# EasyEDA Pro project mpair.eprj

# Schematic mpair

## Sheets
1 POE: Board Name: MPAIR; Create Date: 2026-01-03; Page Name: POE; Project Name: mpair; Schematic Name: mpair; Update Date: 2026-01-04; Company: EasyEDA.com; Page Size: A4; Version: V1.0
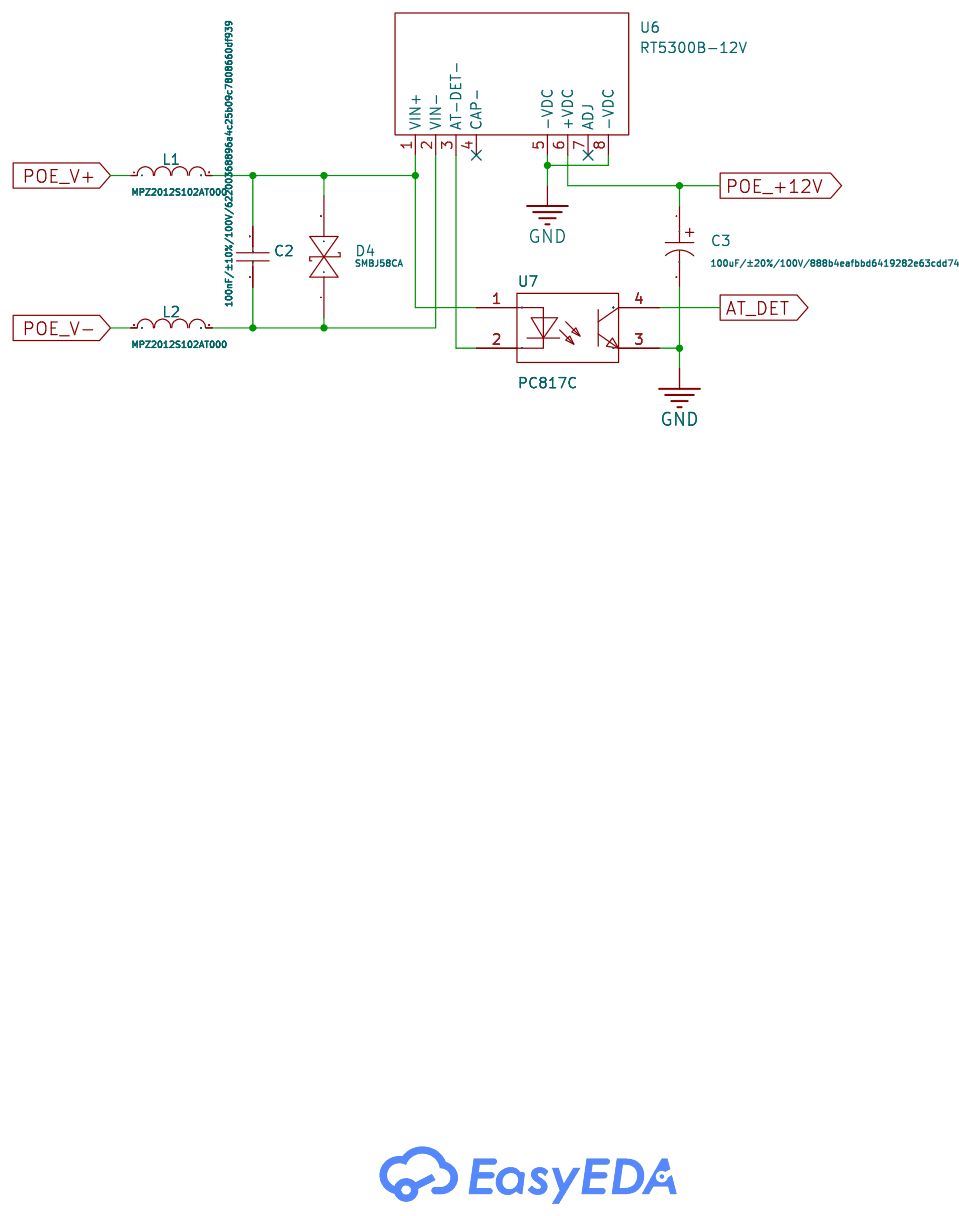
[diagram p0: POE]
2 LAN: Page Name: LAN
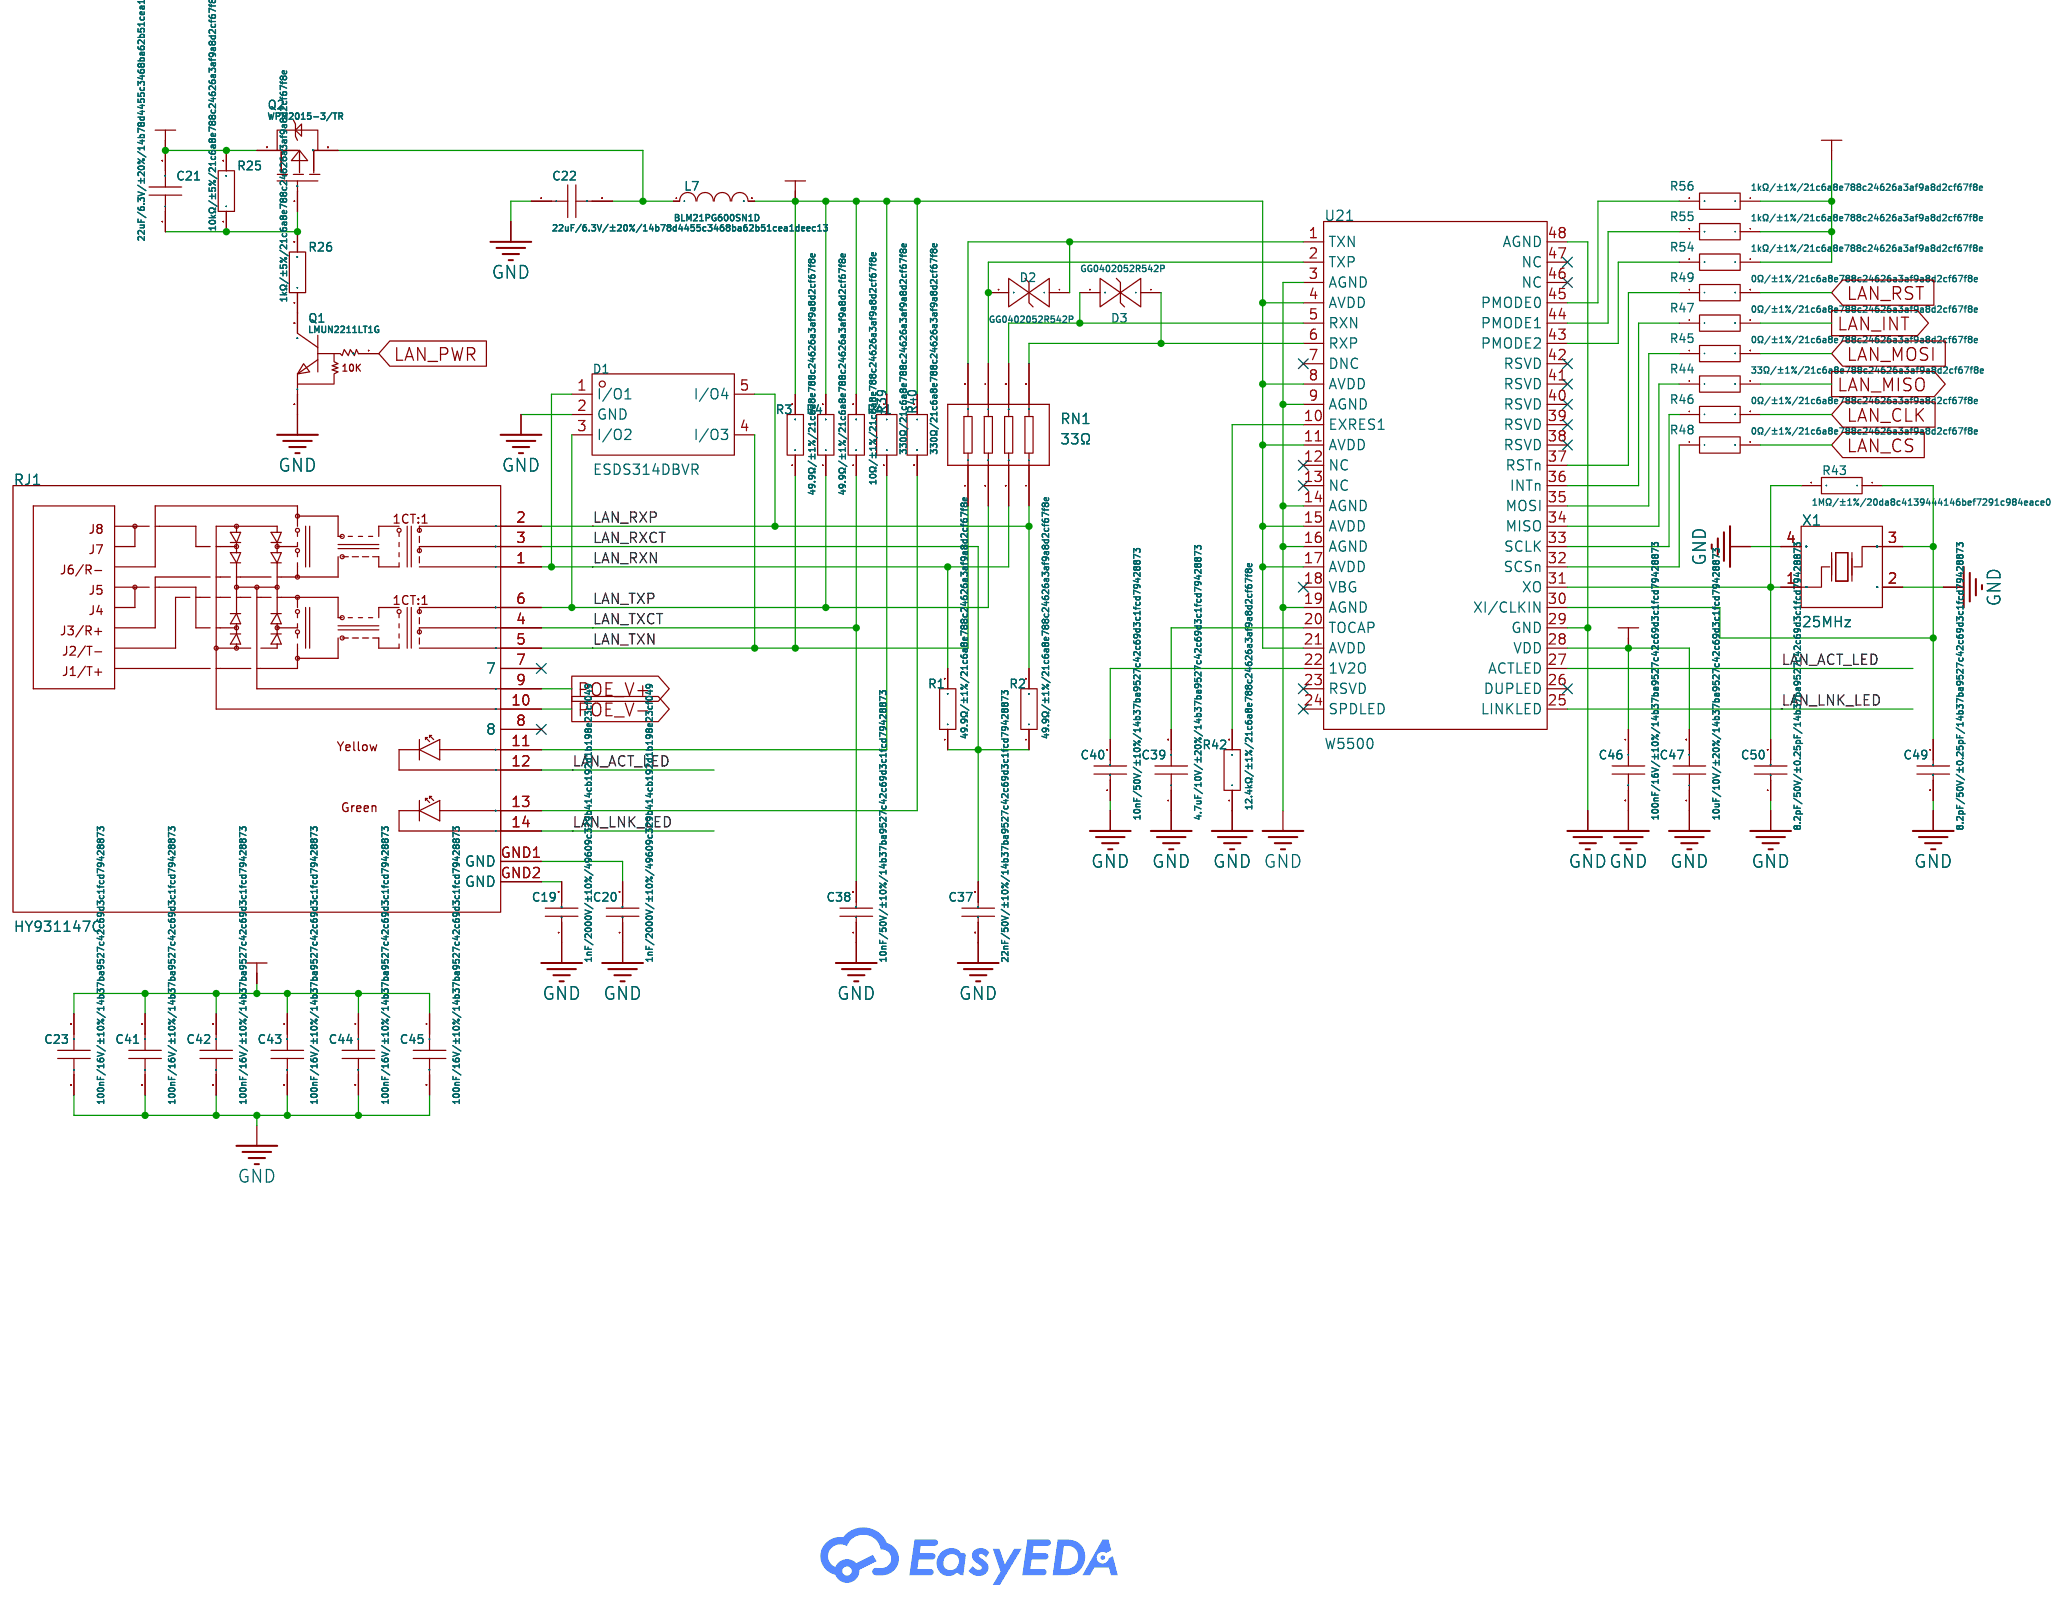
[diagram p1: LAN]
3 ESP32-C6: Page Name: ESP32-C6; Update Date: 2026-01-05
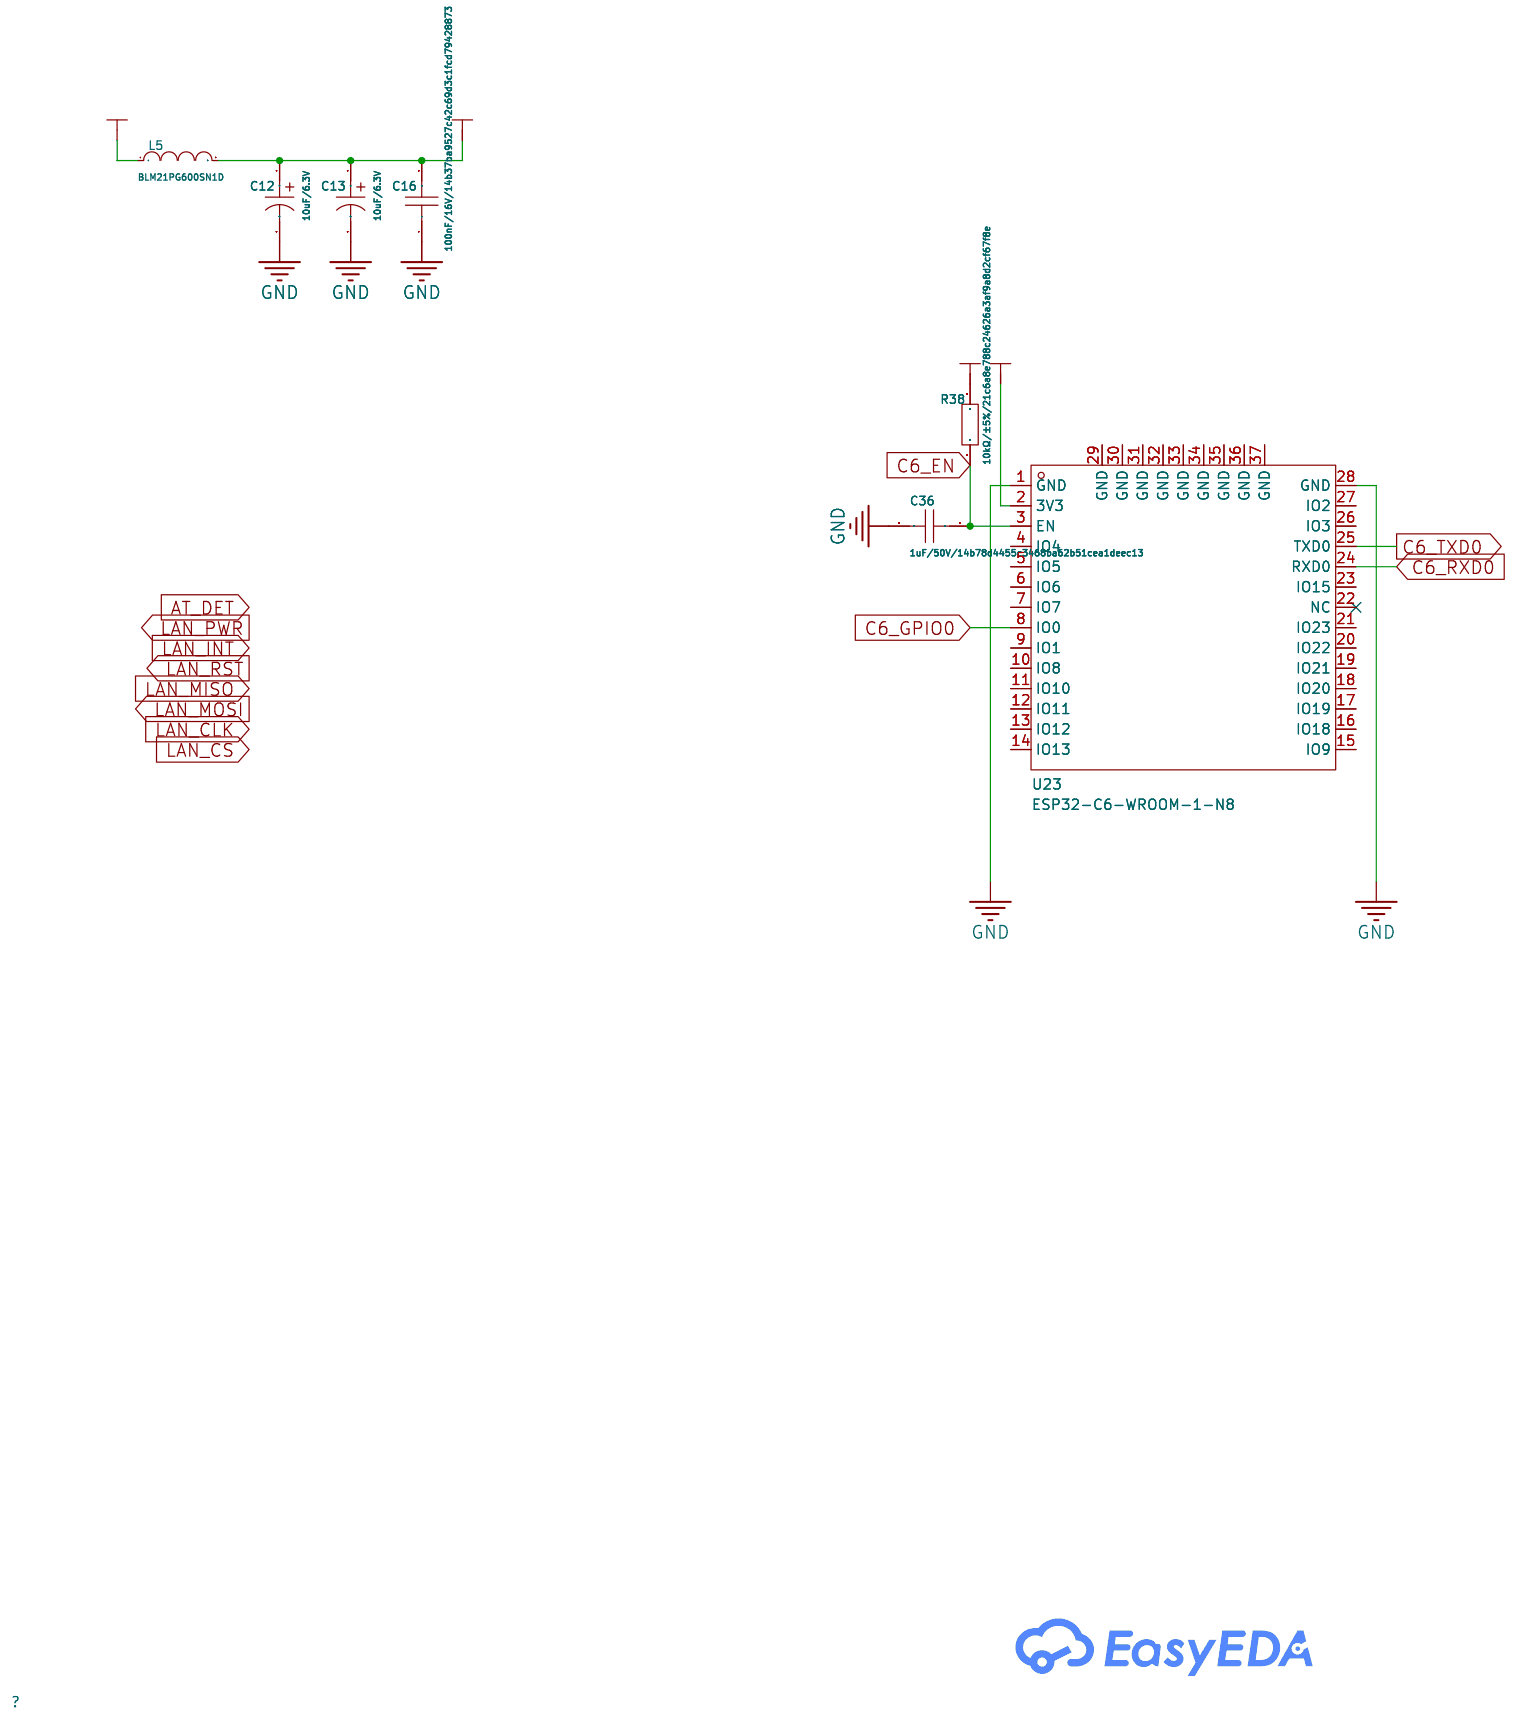
[diagram p2: ESP32-C6]
4 GPS: Page Name: GPS; Update Date: 2026-01-03
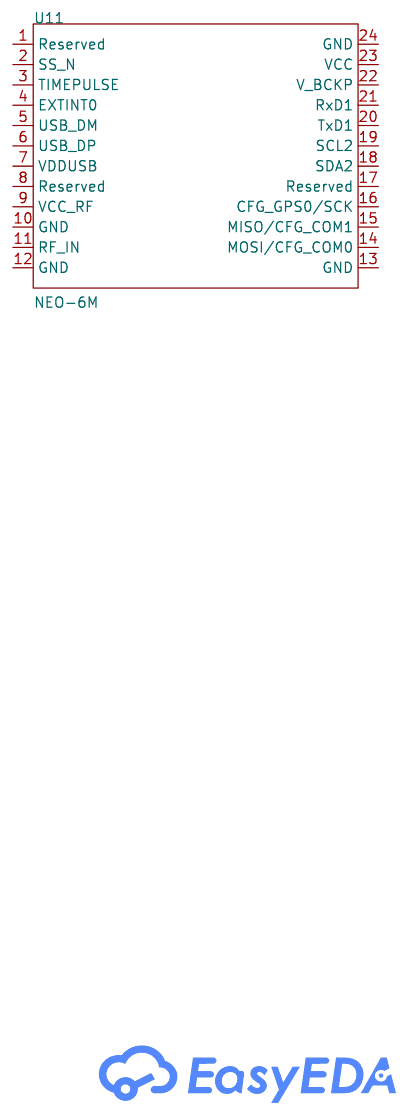
[diagram p3: GPS]
5 SPS30: Page Name: SPS30; Update Date: 2026-01-03
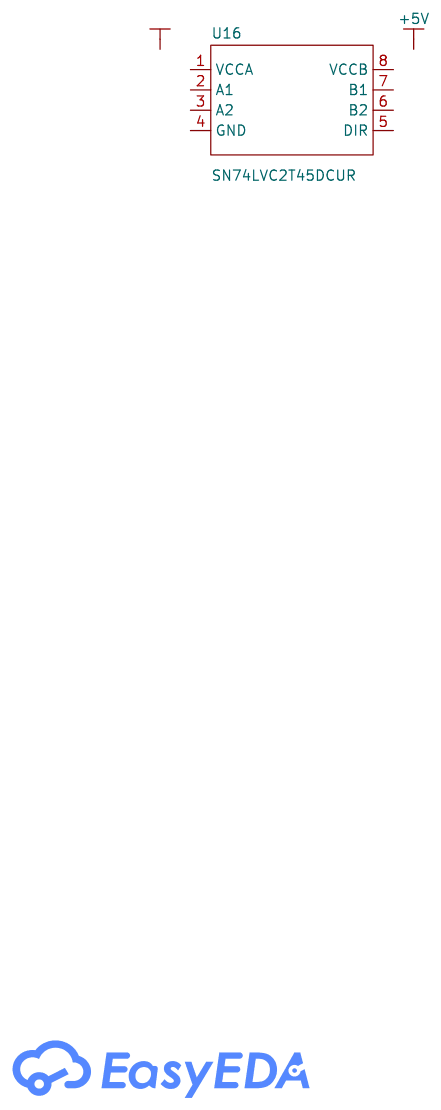
[diagram p4: SPS30]
6 OTHERS: Page Name: OTHERS; Update Date: 2026-01-03
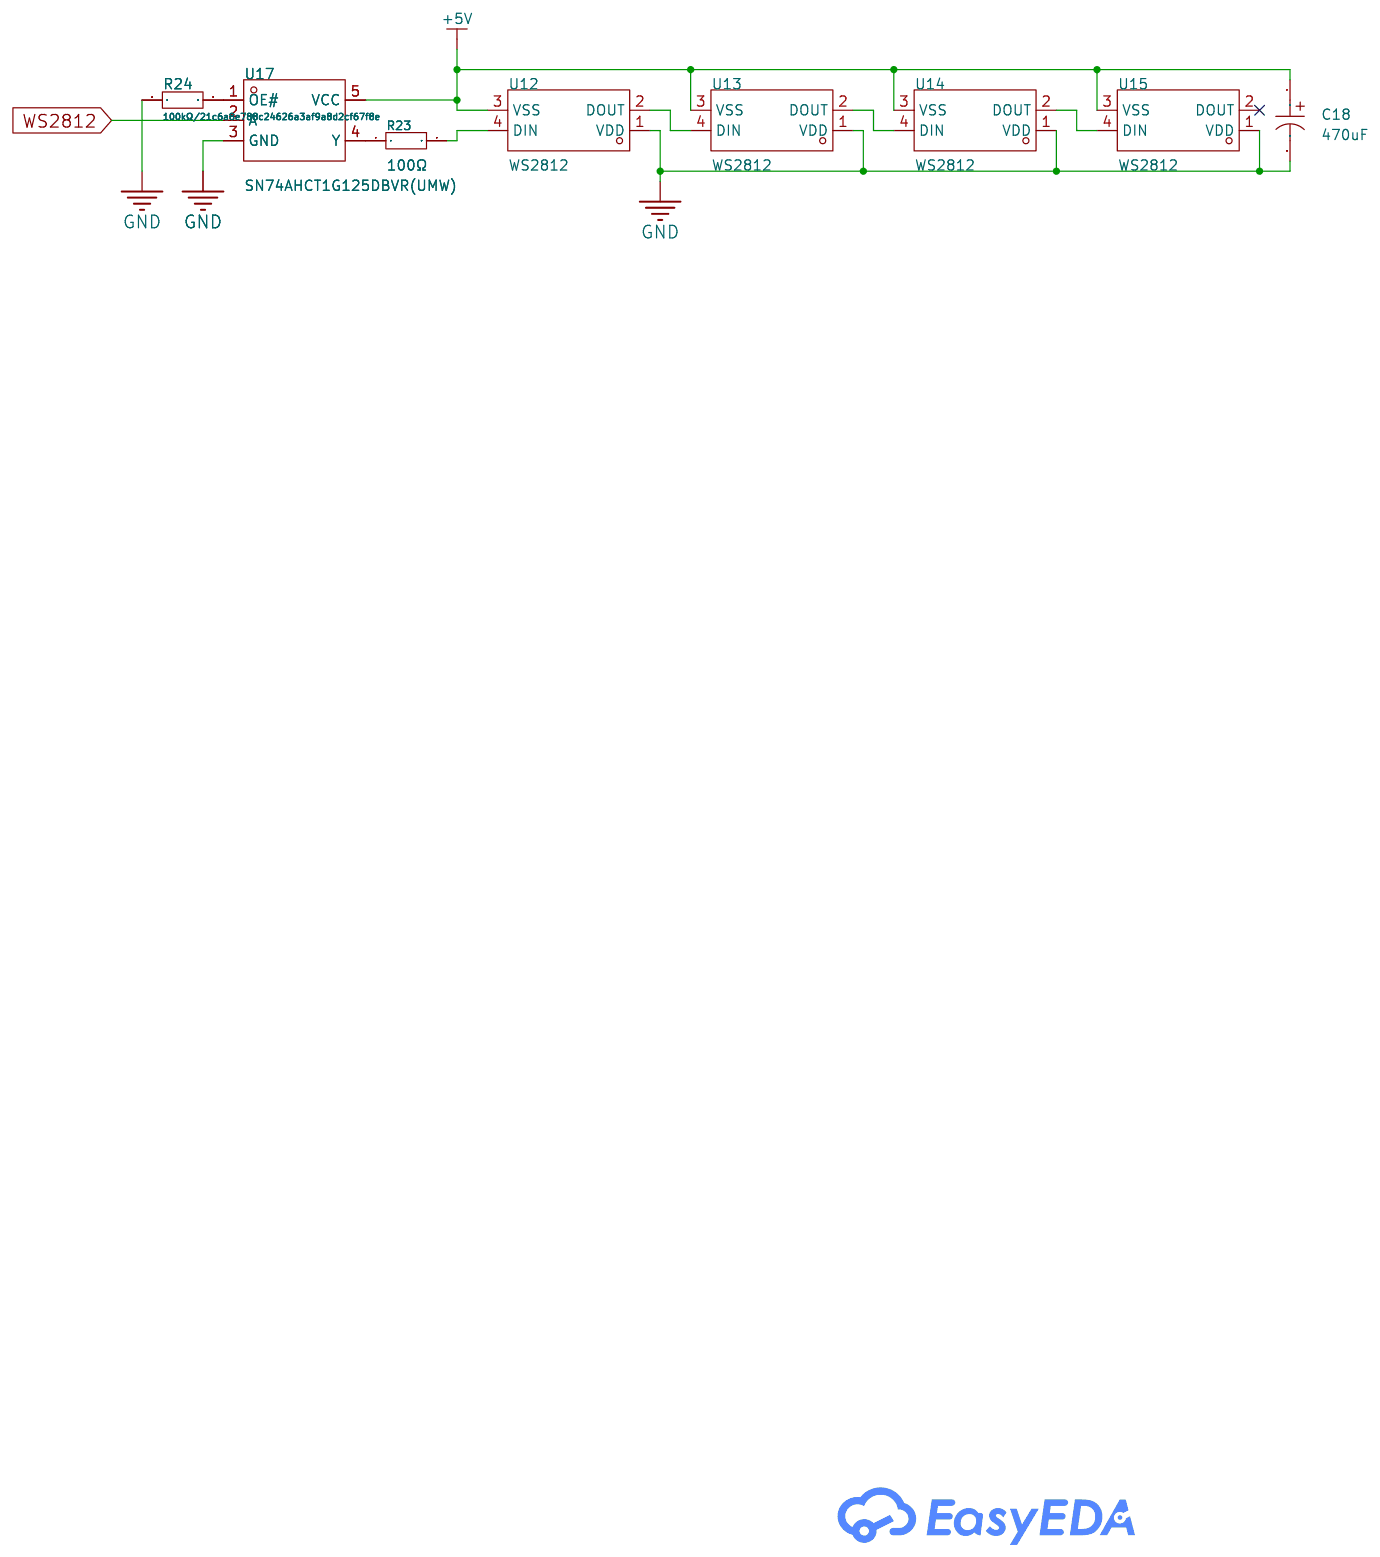
[diagram p5: OTHERS]
7 Power supply: Create Date: 2026-01-04; Page Name: Power supply
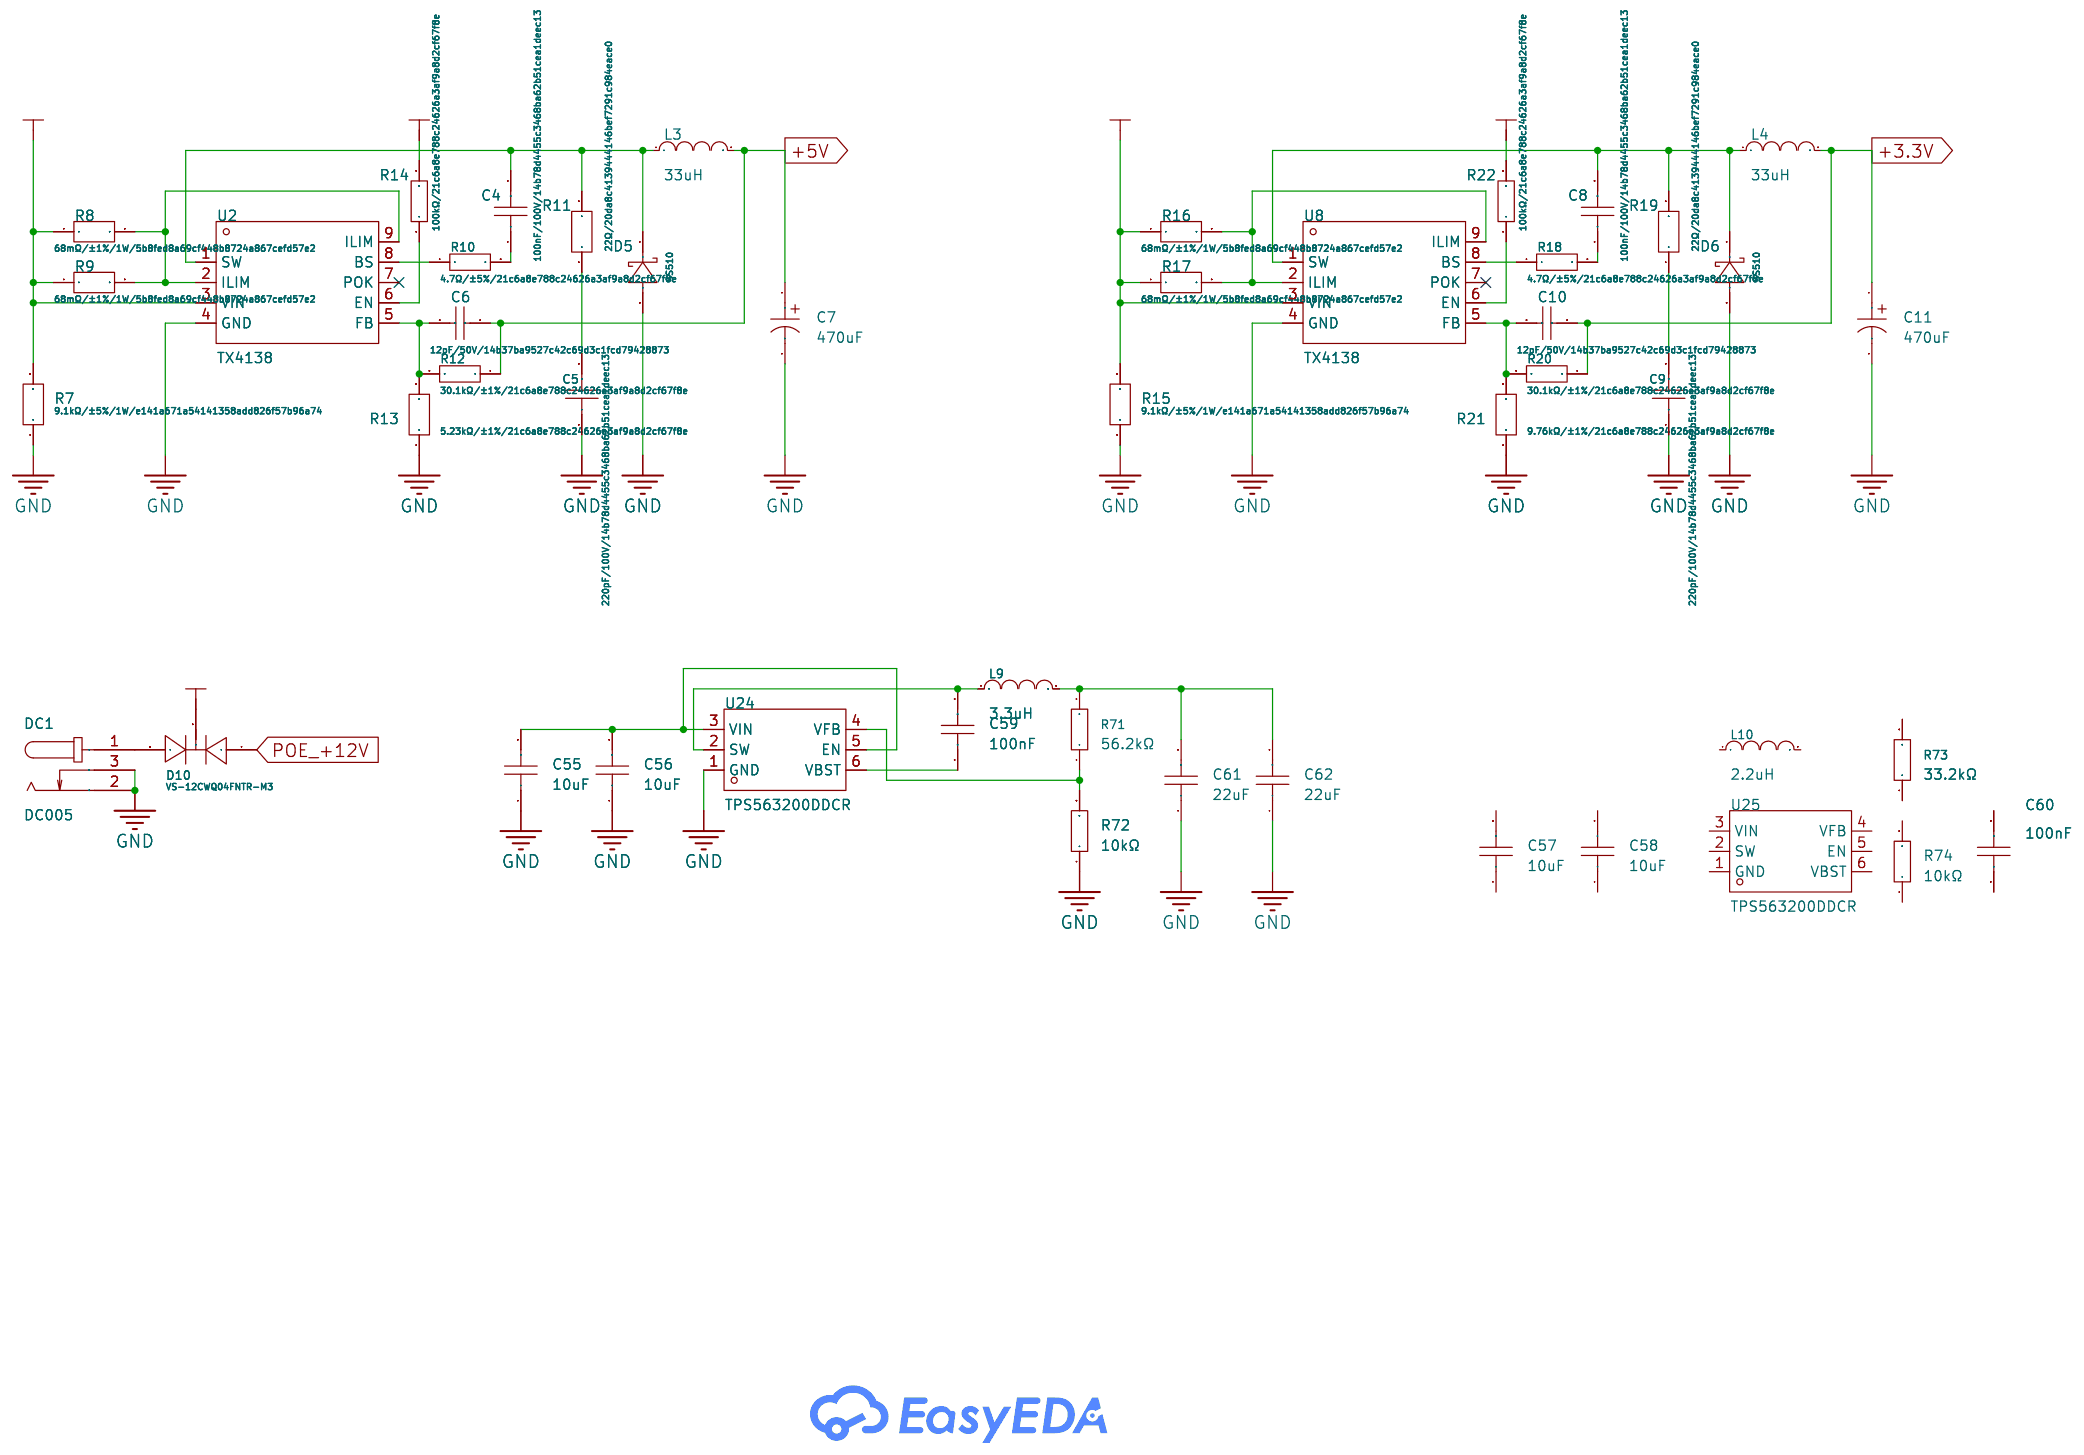
[diagram p6: Power supply]
8 USB->UART: Create Date: 2026-01-04; Page Name: USB->UART; Update Date: 2026-01-05
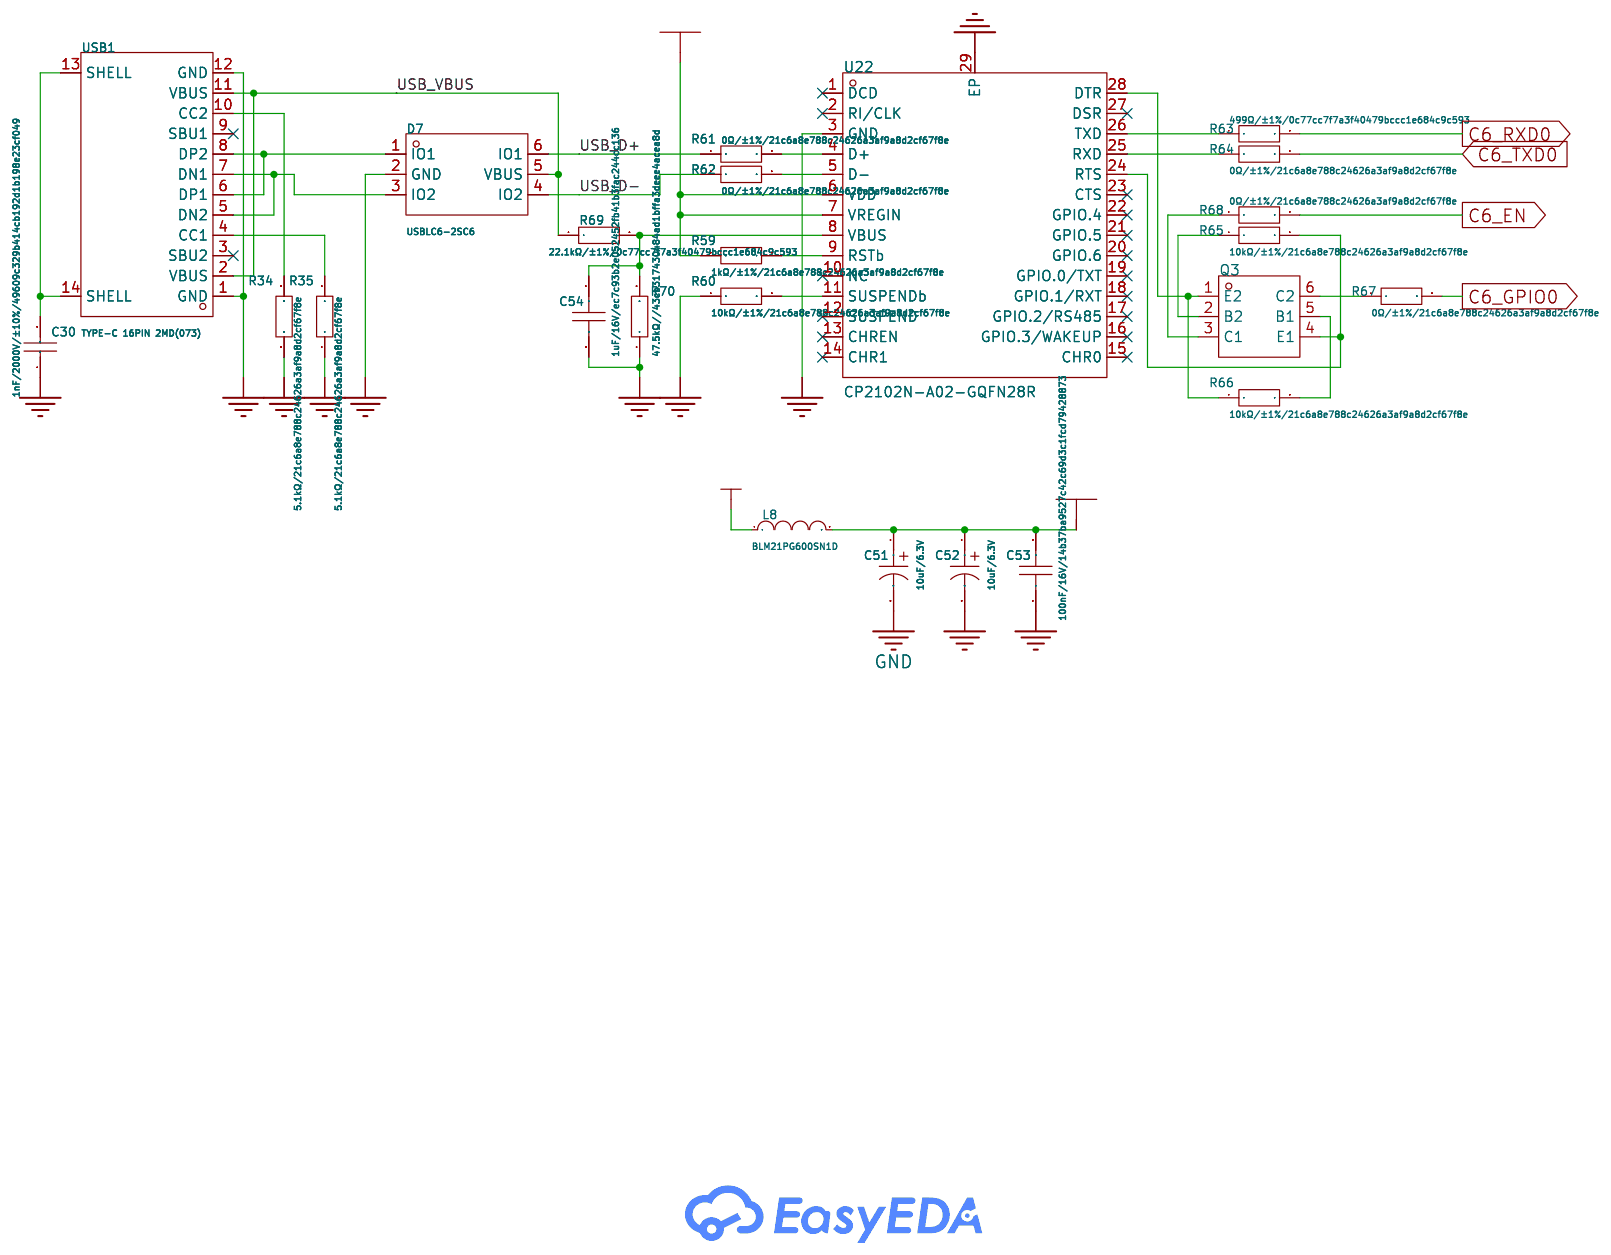
[diagram p7: USB->UART]

## Parts
sheet ESP32-C6
C12  10uF  [CAP-SMD_L2.0-W1.3-FD]
C13  10uF  [CAP-SMD_L2.0-W1.3-FD]
C16  100nF  [C0402]
C36  1uF  [C0603]
L5  BLM21PG600SN1D  [L0805]
R38  10kΩ  [R0402]
U23  ESP32-C6-WROOM-1-N8  [WIRELM-SMD_ESP32-C6-WROOM-1]
sheet GPS
U11  NEO-6M  [GPSM-SMD_24P-L16.0-W12.2-P1.10]
sheet LAN
C19  1nF  [C1206]
C20  1nF  [C1206]
C21  22uF  [C0603]
C22  22uF  [C0603]
C23  100nF  [C0402]
C37  22nF  [C0402]
C38  10nF  [C0402]
C39  4.7uF  [C0402]
C40  10nF  [C0402]
C41  100nF  [C0402]
C42  100nF  [C0402]
C43  100nF  [C0402]
C44  100nF  [C0402]
C45  100nF  [C0402]
C46  100nF  [C0402]
C47  10uF  [C0402]
C49  8.2pF  [C0402]
C50  8.2pF  [C0402]
D1  ESDS314DBVR  [SOT-23-5_L2.9-W1.6-P0.95-LS2.8-BL]
D2  GG0402052R542P  [D0402-BI]
D3  GG0402052R542P  [D0402-BI]
L7  BLM21PG600SN1D  [L0805]
Q1  LMUN2211LT1G  [SOT-23-3_L2.9-W1.3-P1.90-LS2.4-BR]
Q2  WPM2015-3/TR  [SOT-23-3_L2.9-W1.3-P1.90-LS2.4-BR]
R1  49.9Ω  [R0402]
R2  49.9Ω  [R0402]
R3  49.9Ω  [R0402]
R4  49.9Ω  [R0402]
R25  10kΩ  [R0402]
R26  1kΩ  [R0402]
R39  330Ω  [R0402]
R40  330Ω  [R0402]
R41  10Ω  [R0402]
R42  12.4kΩ  [R0402]
R43  1MΩ  [R0603]
R44  33Ω  [R0402]
R45  0Ω  [R0402]
R46  0Ω  [R0402]
R47  0Ω  [R0402]
R48  0Ω  [R0402]
R49  0Ω  [R0402]
R54  1kΩ  [R0402]
R55  1kΩ  [R0402]
R56  1kΩ  [R0402]
RJ1  HY931147C  [RJ45-TH_HY931147C]
RN1  33Ω  [RES-ARRAY-SMD_0402-8P-L2.0-W1.0-BL]
U21  W5500  [LQFP-48_L7.0-W7.0-P0.50-LS9.0-BL]
X1  25MHz  [CRYSTAL-SMD_4P-L3.2-W2.5-BL-2]
sheet OTHERS
C18  470uF  [CAP-SMD_BD6.3-L6.6-W6.6-LS7.6-RD]
R23  100Ω  [R0402]
R24  100kΩ  [R0402]
U12  WS2812  [LED-SMD_4P-L5.0-W5.0-TL-A]
U13  WS2812  [LED-SMD_4P-L5.0-W5.0-TL-A]
U14  WS2812  [LED-SMD_4P-L5.0-W5.0-TL-A]
U15  WS2812  [LED-SMD_4P-L5.0-W5.0-TL-A]
U17  SN74AHCT1G125DBVR(UMW)  [SOT-23-5_L3.0-W1.5-P0.95-LS2.8-BL]
sheet POE
C2  100nF  [C0805]
C3  100uF  [CAP-TH_BD10.0-P5.00-D0.6-FD]
D4  SMBJ58CA  [SMB_L4.6-W3.6-LS5.3-BI]
L1  MPZ2012S102AT000  [L0805]
L2  MPZ2012S102AT000  [L0805]
U6  RT5300B-12V  [PWRM-TH_RT5300B-12V]
U7  PC817C  [SOP-4_L6.5-W4.6-P2.54-LS10.2-TL]
sheet Power supply
C4  100nF  [C0603]
C5  220pF  [C0603]
C6  12pF  [C0402]
C7  470uF  [CAP-SMD_BD6.3-L6.6-W6.6-LS7.6-RD]
C8  100nF  [C0603]
C9  220pF  [C0603]
C10  12pF  [C0402]
C11  470uF  [CAP-SMD_BD6.3-L6.6-W6.6-LS7.6-RD]
C55  10uF  [C1210]
C56  10uF  [C1210]
C57  10uF  [C1210]
C58  10uF  [C1210]
C59  100nF  [C0603]
C60  100nF  [C0603]
C61  22uF  [C0805]
C62  22uF  [C0805]
D5  SS510  [SMA_L4.3-W2.6-LS5.1-RD]
D6  SS510  [SMA_L4.3-W2.6-LS5.1-RD]
D10  VS-12CWQ04FNTR-M3  [DPAK-3_L6.6-W6.1-P2.28-LS9.9-BR]
DC1  DC005  [DC-IN-TH_DC005]
L3  33uH  [IND-SMD_L12.5-W12.5]
L4  33uH  [IND-SMD_L12.5-W12.5]
L9  3.3uH  [IND-SMD_L6.0-W6.0]
L10  2.2uH  [IND-SMD_L4.0-W4.0_LQH44PN2R2MP0L]
R7  9.1kΩ  [R2512]
R8  68mΩ  [R1206]
R9  68mΩ  [R1206]
R10  4.7Ω  [R0402]
R11  22Ω  [R0603]
R12  30.1kΩ  [R0402]
R13  5.23kΩ  [R0402]
R14  100kΩ  [R0402]
R15  9.1kΩ  [R2512]
R16  68mΩ  [R1206]
R17  68mΩ  [R1206]
R18  4.7Ω  [R0402]
R19  22Ω  [R0603]
R20  30.1kΩ  [R0402]
R21  9.76kΩ  [R0402]
R22  100kΩ  [R0402]
R71  56.2kΩ  [R0603]
R72  10kΩ  [R0805]
R73  33.2kΩ  [R0603]
R74  10kΩ  [R0805]
U2  TX4138  [SOIC-8_L4.9-W3.9-P1.27-LS6.0-BL-EP]
U8  TX4138  [SOIC-8_L4.9-W3.9-P1.27-LS6.0-BL-EP]
U24  TPS563200DDCR  [SOT-23-6_L2.9-W1.6-P0.95-LS2.8-BR]
U25  TPS563200DDCR  [SOT-23-6_L2.9-W1.6-P0.95-LS2.8-BR]
sheet SPS30
U16  SN74LVC2T45DCUR  [VSSOP-8_L2.4-W2.1-P0.50-LS3.2-BR]
sheet USB->UART
C30  1nF  [C1206]
C51  10uF  [CAP-SMD_L2.0-W1.3-FD]
C52  10uF  [CAP-SMD_L2.0-W1.3-FD]
C53  100nF  [C0402]
C54  1uF  [C0402]
D7  USBLC6-2SC6  [SOT-23-6_L2.9-W1.6-P0.95-LS2.8-BL]
L8  BLM21PG600SN1D  [L0805]
Q3  -  [SOT-363_L2.0-W1.3-P0.65-LS2.1-TL]
R34  5.1kΩ  [R0402]
R35  5.1kΩ  [R0402]
R59  1kΩ  [R0402]
R60  10kΩ  [R0402]
R61  0Ω  [R0402]
R62  0Ω  [R0402]
R63  499Ω  [R0402]
R64  0Ω  [R0402]
R65  10kΩ  [R0402]
R66  10kΩ  [R0402]
R67  0Ω  [R0402]
R68  0Ω  [R0402]
R69  22.1kΩ  [R0402]
R70  47.5kΩ  [R0603]
U22  CP2102N-A02-GQFN28R  [QFN-28_L5.0-W5.0-P0.50-TL-EP3.3]
USB1  TYPE-C 16PIN 2MD(073)  [USB-C-SMD_TYPE-C-6PIN-2MD-073]

## Library data of the parts
C12 C13 C51 C52 = CA45-P-6.3V-10UF-K: LCSC Part Name: 10uF ±10% 6.3V; Supplier Part: C2844395; Manufacturer: CEC(振华新云); Supplier Footprint: CASE-P-2012-12(mm); JLCPCB Part Class: Extended Part; Datasheet: https://item.szlcsc.com/datasheet/CA45-P-6.3V-10UF-K/3035205.html; Supplier: LCSC; Tolerance: ±10%; Voltage Rating: 6.3V; Current - Leakage: 600nA; Operating Temperature: -55℃~+125℃
C16 C23 C41-C46 C53 = CL05B104KO5NNNC: LCSC Part Name: 100nF ±10% 16V; Supplier Part: C1525; Manufacturer: SAMSUNG(三星); Supplier Footprint: 0402; JLCPCB Part Class: Basic Part; Datasheet: https://item.szlcsc.com/datasheet/CL05B104KO5NNNC/1877.html; Supplier: LCSC; Tolerance: ±10%; Voltage Rating: 16V; Temperature Coefficient: X7R
C36 = CL10A105KB8NNNC: LCSC Part Name: 1uF ±10% 50V; Supplier Part: C15849; Manufacturer: SAMSUNG(三星); Supplier Footprint: 0603; JLCPCB Part Class: Basic Part; Datasheet: https://item.szlcsc.com/datasheet/CL10A105KB8NNNC/16531.html; Supplier: LCSC; Tolerance: ±10%; Voltage Rating: 50V; Temperature Coefficient: X5R
L5 L7 L8 = BLM21PG600SN1D: LCSC Part Name: 单路 0805磁珠 阻抗60Ω@100MHz; Supplier Part: C18305; Manufacturer: muRata(村田); Supplier Footprint: 0805; JLCPCB Part Class: Extended Part; Datasheet: https://item.szlcsc.com/datasheet/BLM21PG600SN1D/19000.html; Supplier: LCSC; Impedance @ Frequency: 60Ω@100MHz; Tolerance: ±25%; DC Resistance(DCR): 20mΩ; Current Rating: 3.5A; Number of Circuits: 1
R25 R38 = RC0402JR-0710KL: LCSC Part Name: 厚膜电阻 10kΩ ±5% 62.5mW; Supplier Part: C60489; Manufacturer: YAGEO(国巨); Supplier Footprint: 0402; JLCPCB Part Class: Extended Part; Datasheet: https://item.szlcsc.com/datasheet/RC0402JR-0710KL/61541.html; Supplier: LCSC; Type: Thick Film Resistors; Tolerance: ±5%; Power(Watts): 62.5mW; Voltage-Supply(Max): 50V; Temperature Coefficient: ±100ppm/℃; Operating Temperature: -55℃~+155℃
U23 = ESP32-C6-WROOM-1-N8: Supplier Part: C5366877; Manufacturer: ESPRESSIF(乐鑫); JLCPCB Part Class: Extended Part; Datasheet: https://item.szlcsc.com/datasheet/ESP32-C6-WROOM-1-N8/6203223.html; Supplier: LCSC
U11 = NEO-6M: Supplier Part: C2927633; JLCPCB Part Class: Extended Part; Supplier: LCSC
C19 C20 C30 = 1206B102K202NT: LCSC Part Name: 1nF ±10% 2kV; Supplier Part: C9196; Manufacturer: FH(风华); Supplier Footprint: 1206; JLCPCB Part Class: Basic Part; Datasheet: https://atta.szlcsc.com/upload/public/pdf/source/20200305/C486355_26A10D38EF8C2A5C37091D0039909270.pdf; Supplier: LCSC; Tolerance: ±10%; Voltage Rating: 2000V; Temperature Coefficient: X7R
C21 C22 = CL10A226MQ8NRNC: LCSC Part Name: 22uF ±20% 6.3V; Supplier Part: C59461; Manufacturer: SAMSUNG(三星); Supplier Footprint: 0603; JLCPCB Part Class: Basic Part; Datasheet: https://item.szlcsc.com/datasheet/CL10A226MQ8NRNC/60514.html; Supplier: LCSC; Tolerance: ±20%; Voltage Rating: 6.3V; Temperature Coefficient: X5R
C37 = CL05B223KB5NNNC: LCSC Part Name: 22nF ±10% 50V; Supplier Part: C337699; Manufacturer: SAMSUNG(三星); Supplier Footprint: 0402; JLCPCB Part Class: Extended Part; Datasheet: https://item.szlcsc.com/datasheet/CL05B223KB5NNNC/315756.html; Supplier: LCSC; Tolerance: ±10%; Voltage Rating: 50V; Temperature Coefficient: X7R
C38 C40 = CC0402KRX7R9BB103: LCSC Part Name: 10nF ±10% 50V; Supplier Part: C60133; Manufacturer: YAGEO(国巨); Supplier Footprint: 0402; JLCPCB Part Class: Extended Part; Datasheet: https://item.szlcsc.com/datasheet/CC0402KRX7R9BB103/61185.html; Supplier: LCSC; Tolerance: ±10%; Voltage Rating: 50V; Temperature Coefficient: X7R
C39 = V475M0402X5R100NCT: LCSC Part Name: 4.7uF ±20% 10V; Supplier Part: C2691404; Manufacturer: VIIYONG(微容); Supplier Footprint: 0402; JLCPCB Part Class: Extended Part; Datasheet: https://item.szlcsc.com/datasheet/V475M0402X5R100NCT/2800924.html; Supplier: LCSC; Tolerance: ±20%; Voltage Rating: 10V
C47 = CL05A106MP5NUNC_C315248: LCSC Part Name: 10uF ±20% 10V; Supplier Part: C315248; Manufacturer: SAMSUNG(三星); Manufacturer Part: CL05A106MP5NUNC; Supplier Footprint: 0402; JLCPCB Part Class: Extended Part; Datasheet: https://item.szlcsc.com/datasheet/CL05A106MP5NUNC/297154.html; Supplier: LCSC; Tolerance: ±20%; Voltage Rating: 10V; Temperature Coefficient: X5R
C49 C50 = 0402CG8R2C500NT: LCSC Part Name: ±0.25pF 8.2pF 50V; Supplier Part: C1579; Manufacturer: FH(风华); Supplier Footprint: 0402; JLCPCB Part Class: Extended Part; Datasheet: https://item.szlcsc.com/datasheet/0402CG8R2C500NT/1931.html; Supplier: LCSC; Voltage Rating: 50V; Temperature Coefficient: C0G; Tolerance: ±0.25pF
D1 = ESDS314DBVR: LCSC Part Name: 单向ESD 3.6V截止 峰值浪涌电流：25A@8/20us; Supplier Part: C1847859; Manufacturer: TI(德州仪器); Supplier Footprint: SOT-23-5; JLCPCB Part Class: Extended Part; Datasheet: https://www.ti.com/cn/lit/gpn/esds314; Supplier: LCSC; Polarity: Unidirectional; Reverse Stand-Off Voltage (Vrwm): 3.6V; Clamping Voltage: 6.5V; Peak Pulse Current (Ipp): 25A@8/20us; Peak Pulse Power Dissipation (Ppp): 170W@8/20us; Voltage - Breakdown: 7.5V; Reverse Leakage Current (Ir): 5nA; Number of Channels: 4; Operating Temperature: -40℃~+125℃; level of protection: IEC 61000-4-4；IEC 61000-4-5；IEC 61000-4-2; Type: ESD; Junction Capacitance: 4.5pF
D2 D3 = GG0402052R542P: LCSC Part Name: ESD 5V截止 峰值脉冲电流：3A@8/20us; Supplier Part: C1973257; Manufacturer: Kyocera AVX; Supplier Footprint: 0402; JLCPCB Part Class: Extended Part; Supplier: LCSC; Reverse Stand-Off Voltage (Vrwm): 5V; Clamping Voltage: 15.5V; Peak Pulse Current (Ipp): 3A@8/20us; Peak Pulse Power Dissipation (Ppp): 46W@8/20us; Voltage - Breakdown: 5.5V; Reverse Leakage Current (Ir): 100nA; Operating Temperature: -55℃~+125℃; level of protection: IEC 61000-4-4；IEC 61000-4-2; Type: ESD; Junction Capacitance: 2.5pF
Q1 = LMUN2211LT1G: LCSC Part Name: 偏置电阻晶体管，带单片偏置电阻网络的NPN硅表面贴装晶体管; Supplier Part: C12775; Manufacturer: LRC(乐山无线电); Supplier Footprint: SOT-23; JLCPCB Part Class: Extended Part; Datasheet: https://item.szlcsc.com/datasheet/LMUN2211LT1G/13416.html; Supplier: LCSC; Collector - Emitter Voltage VCEO: 50V; Current - Collector(Ic): 100mA; Pd - Power Dissipation: 246mW; type: NPN; DC Current Gain: 35@5.0mA,10V; Output Voltage(VO(on)): 200mV; Input Resistor: 10kΩ; Resistor Ratio: 1; Operating Temperature: -55℃~+150℃
Q2 = WPM2015-3/TR_C7472861: LCSC Part Name: 耐压:20V 电流:2.8A; Supplier Part: C7472861; Manufacturer: TECH PUBLIC(台舟); Supplier Footprint: SOT-23; JLCPCB Part Class: Extended Part; Datasheet: https://item.szlcsc.com/datasheet/WPM2015-3%252FTR/8532708.html; Supplier: LCSC; Drain to Source Voltage: 20V; Current - Continuous Drain(Id): 2.8A; RDS(on): 80mΩ@2.5V,2A; Pd - Power Dissipation: 1.25W; Gate Threshold Voltage (Vgs(th)): 450mV; Gate Charge(Qg): 9.6nC@4.5V; Input Capacitance(Ciss): 1.16nF; Reverse Transfer Capacitance (Crss@Vds): 125pF; Operating Temperature: -55℃~+150℃; Output Capacitance(Coss): 210pF
R1-R4 = CR0402FF49R9G: LCSC Part Name: 厚膜电阻 49.9Ω ±1% 62.5mW; Supplier Part: C100459; Manufacturer: LIZ(丽智电子); Supplier Footprint: 0402; JLCPCB Part Class: Extended Part; Datasheet: https://atta.szlcsc.com/upload/public/pdf/source/20180403/C189438_6D658388CC7843F35BBC9018D03F0B8E.pdf; Supplier: LCSC; Type: Thick Film Resistors; Tolerance: ±1%; Temperature Coefficient: ±200ppm/℃; Operating Temperature Range: -55℃~+125℃
R26 = RC0402JR-071KL: LCSC Part Name: 厚膜电阻 1kΩ ±5% 62.5mW; Supplier Part: C105637; Manufacturer: YAGEO(国巨); Supplier Footprint: 0402; JLCPCB Part Class: Extended Part; Datasheet: https://item.szlcsc.com/datasheet/RC0402JR-071KL/106852.html; Supplier: LCSC; Type: Thick Film Resistor; Tolerance: ±5%; Power(Watts): 62.5mW; Voltage-Supply(Max): 50V; Temperature Coefficient: ±100ppm/℃; Operating Temperature: -55℃~+155℃
R39 R40 = FRC0402J331 TS: LCSC Part Name: 330Ω ±5% 62.5mW 厚膜电阻; Supplier Part: C2906929; Manufacturer: FOJAN(富捷); Supplier Footprint: 0402; JLCPCB Part Class: Extended Part; Supplier: LCSC; Type: Thick Film Resistor; Tolerance: ±5%; Power(Watts): 62.5mW; Voltage-Supply(Max): 50V; Temperature Coefficient: ±100ppm/℃; Operating Temperature: -55℃~+155℃
R41 = 0402WGF100JTCE: LCSC Part Name: 10Ω ±1% 62.5mW 厚膜电阻; Supplier Part: C25077; Manufacturer: UNI-ROYAL(厚声); Supplier Footprint: 0402; JLCPCB Part Class: Basic Part; Datasheet: https://item.szlcsc.com/datasheet/0402WGF100JTCE/25820.html; Supplier: LCSC; Type: Thick Film Resistor; Tolerance: ±1%; Power(Watts): 62.5mW; Voltage-Supply(Max): 50V; Temperature Coefficient: ±200ppm/℃; Operating Temperature: -55℃~+155℃
R42 = RC0402FR-0712K4L: LCSC Part Name: 厚膜电阻 12.4kΩ ±1% 62.5mW; Supplier Part: C138060; Manufacturer: YAGEO(国巨); Supplier Footprint: 0402; JLCPCB Part Class: Extended Part; Datasheet: https://item.szlcsc.com/datasheet/RC0402FR-0712K4L/149376.html; Supplier: LCSC; Type: Thick Film Resistor; Tolerance: ±1%; Power(Watts): 62.5mW; Voltage-Supply(Max): 50V; Temperature Coefficient: ±100ppm/℃; Operating Temperature: -55℃~+155℃
R43 = 0603WAF1004T5E: LCSC Part Name: 1MΩ ±1% 100mW 厚膜电阻; Supplier Part: C22935; Manufacturer: UNI-ROYAL(厚声); Supplier Footprint: 0603; JLCPCB Part Class: Basic Part; Datasheet: https://atta.szlcsc.com/upload/public/pdf/source/20200306/C422600_1E6D84923E4A46A82E41ADD87F860B5C.pdf; Supplier: LCSC; Type: Thick Film Resistors; Tolerance: ±1%; Temperature Coefficient: ±100ppm/℃; Operating Temperature Range: -55℃~+155℃
R44 = 0402WGF330JTCE: LCSC Part Name: 33Ω ±1% 62.5mW 厚膜电阻; Supplier Part: C25105; Manufacturer: UNI-ROYAL(厚声); Supplier Footprint: 0402; JLCPCB Part Class: Basic Part; Datasheet: https://item.szlcsc.com/datasheet/0402WGF330JTCE/25848.html; Supplier: LCSC; Type: Thick Film Resistor; Tolerance: ±1%; Power(Watts): 62.5mW; Voltage-Supply(Max): 50V; Temperature Coefficient: ±100ppm/℃; Operating Temperature: -55℃~+155℃
R45-R49 R61 R62 R64 R67 R68 = 0402WGF0000TCE: LCSC Part Name: 0Ω ±1% 62.5mW 厚膜电阻; Supplier Part: C17168; Manufacturer: UNI-ROYAL(厚声); Supplier Footprint: 0402; JLCPCB Part Class: Basic Part; Datasheet: https://item.szlcsc.com/datasheet/0402WGF0000TCE/17853.html; Supplier: LCSC; Type: Thick Film Resistor; Tolerance: ±1%; Power(Watts): 62.5mW; Voltage-Supply(Max): 50V; Temperature Coefficient: ±800ppm/℃; Operating Temperature: -55℃~+155℃
R54-R56 R59 = 0402WGF1001TCE: LCSC Part Name: 1kΩ ±1% 62.5mW 厚膜电阻; Supplier Part: C11702; Manufacturer: UNI-ROYAL(厚声); Supplier Footprint: 0402; JLCPCB Part Class: Basic Part; Datasheet: https://item.szlcsc.com/datasheet/0402WGF1001TCE/12256.html; Supplier: LCSC; Type: Thick Film Resistor; Tolerance: ±1%; Power(Watts): 62.5mW; Voltage-Supply(Max): 50V; Temperature Coefficient: ±100ppm/℃; Operating Temperature: -55℃~+155℃
RJ1 = HY931147C: LCSC Part Name: 弯插 带LED; Supplier Part: C91754; Manufacturer: HANRUN(汉仁); Supplier Footprint: 插件; JLCPCB Part Class: Extended Part; Datasheet: https://item.szlcsc.com/datasheet/HY931147C/92943.html; Supplier: LCSC; Connector Type: RJ45 Jack; Mounting Type: Right Angle; Number of Ports: 1; LED: With LED; Shielding: Shielded; PoE: With PoE; Supplementary Features: With Contact Spring
RN1 = YC124-FR-0733RL: LCSC Part Name: 33Ω ±1%; Supplier Part: C136851; Manufacturer: YAGEO(国巨); Supplier Footprint: 0402x4; JLCPCB Part Class: Extended Part; Datasheet: https://item.szlcsc.com/datasheet/YC124-FR-0733RL/148167.html; Supplier: LCSC; Tolerance: ±1%; Power(Watts): 62.5mW; Temperature Coefficient: ±200ppm/℃
U21 = W5500: LCSC Part Name: W5500硬连线TCP/IP嵌入式以太网控制器; Supplier Part: C32843; Manufacturer: WIZNET; Supplier Footprint: LQFP-48(7x7); JLCPCB Part Class: Extended Part; Datasheet: https://item.szlcsc.com/datasheet/W5500/33808.html; Supplier: LCSC; Number of Channels: 8; Interface: SPI; Voltage - Supply: 3.3V; Current - Supply: 132mA; Operating Temperature: -40℃~+85℃
X1 = X322525MSB4SI: LCSC Part Name: YSX321SL 25MHZ 4P 3225 20PF ±10PPM -40~85℃ (±20PPM); Supplier Part: C13740; Manufacturer: YXC(扬兴晶振); Supplier Footprint: SMD3225-4P; JLCPCB Part Class: Extended Part; Datasheet: https://item.szlcsc.com/datasheet/X322525MSB4SI/14395.html; Supplier: LCSC; Type: Crystal Oscillator; Normal temperature Frequency Tolerance: ±10ppm; Load Capacitance: 20pF; Frequency Stability: ±20ppm; Operating Temperature: -40℃~+85℃
C7 C11 C18 = RVT1C471M0607: LCSC Part Name: 470uF ±20% 16V; Supplier Part: C2977552; Manufacturer: ROQANG(容强); Supplier Footprint: SMD,D6.3xL7.7mm; JLCPCB Part Class: Extended Part; Supplier: LCSC; Tolerance: ±20%; Voltage Rating: 16V; Ripple Current: 185mA@120Hz; Diameter: 6.3mm; Height - Seated (Max): 7.7mm; Lifetime: 2000hrs@105℃; Operating Temperature: -40℃~+105℃
R23 = 0402WGJ0101TCE: LCSC Part Name: 100Ω ±5% 62.5mW 厚膜电阻; Supplier Part: C25138; Manufacturer: UNI-ROYAL(厚声); Supplier Footprint: 0402; JLCPCB Part Class: Extended Part; Datasheet: https://item.szlcsc.com/datasheet/0402WGJ0101TCE/25881.html; Supplier: LCSC; Type: Thick Film Resistor; Tolerance: ±5%; Power(Watts): 62.5mW; Voltage-Supply(Max): 50V; Temperature Coefficient: ±100ppm/℃; Operating Temperature: -55℃~+155℃
R14 R22 R24 = RC0402FR-07100KL: LCSC Part Name: 厚膜电阻 100kΩ ±1% 62.5mW; Supplier Part: C60491; Manufacturer: YAGEO(国巨); Supplier Footprint: 0402; JLCPCB Part Class: Extended Part; Datasheet: https://item.szlcsc.com/datasheet/RC0402FR-07100KL/61543.html; Supplier: LCSC; Type: Thick Film Resistor; Tolerance: ±1%; Power(Watts): 62.5mW; Voltage-Supply(Max): 50V; Temperature Coefficient: ±100ppm/℃; Operating Temperature: -55℃~+155℃
U12-U15 = WS2812: Supplier Part: C42417498; Manufacturer: worldsemi; Supplier Footprint: SMD5050-4P; JLCPCB Part Class: Extended Part; Datasheet: https://item.szlcsc.com/datasheet/WS2812/44423158.html; Supplier: LCSC
U17 = SN74AHCT1G125DBVR(UMW): Supplier Part: C20617903; Manufacturer: UMW(友台半导体); Supplier Footprint: SOT-23-5; JLCPCB Part Class: Extended Part; Datasheet: https://atta.szlcsc.com/upload/public/pdf/source/20240202/859E6FB7F814FD8595A6844FA9E492AF.pdf; Supplier: LCSC
C2 = CL21B104KCFNNNE: LCSC Part Name: 100nF ±10% 100V; Supplier Part: C28233; Manufacturer: SAMSUNG(三星); Supplier Footprint: 0805; JLCPCB Part Class: Basic Part; Datasheet: https://item.szlcsc.com/datasheet/CL21B104KCFNNNE/28983.html; Supplier: LCSC; Tolerance: ±10%; Voltage Rating: 100V; Temperature Coefficient: X7R
C3 = 100uF100V10x17GF: LCSC Part Name: 100uF ±20% 100V; Supplier Part: C49304981; Manufacturer: Econd(米朗电子); Supplier Footprint: 插件,D10xL17mm; JLCPCB Part Class: Extended Part; Datasheet: https://item.szlcsc.com/datasheet/100uF100V10x17GF/51766809.html; Supplier: LCSC; Tolerance: ±20%; Voltage Rating: 100V; Ripple Current: 540mA@100KHz; Equivalent Series Resistance(ESR): 200mΩ; Pin Spacing: 5mm; Diameter: 10mm; Height - Seated (Max): 17mm; Lifetime: 3000hrs@105℃; Operating Temperature: -40℃~+105℃
D4 = SMBJ58CA_C492914: Supplier Part: C492914; Manufacturer: SMC(桑德斯); Supplier Footprint: DO-214AA(SMB); JLCPCB Part Class: Extended Part; Datasheet: https://atta.szlcsc.com/upload/public/pdf/source/20200312/C493201_B8845F97AAB6FA9414561D1241F12A71.pdf; Supplier: LCSC; Polarity: Bidirectional; Reverse Stand-Off Voltage (Vrwm): 58V; Clamping Voltage: 93.6V; Peak Pulse Current (Ipp): 6.5A; Peak Pulse Power Dissipation (Ppp): 600W; Voltage - Breakdown: 64.4V; Type: TVS
L1 L2 = MPZ2012S102AT000: LCSC Part Name: 单路 0805磁珠 阻抗1kΩ@100MHz; Supplier Part: C76817; Manufacturer: TDK; Supplier Footprint: 0805; JLCPCB Part Class: Extended Part; Datasheet: https://item.szlcsc.com/datasheet/MPZ2012S102AT000/77944.html; Supplier: LCSC; Impedance @ Frequency: 1kΩ@100MHz; Tolerance: ±25%; DC Resistance(DCR): 150mΩ; Current Rating: 1.5A; Number of Circuits: 1; Operating Temperature: -55℃~+125℃
U6 = RT5300B-12V: Supplier Part: C9900202773; Supplier Footprint: Through hole; JLCPCB Part Class: Extended Part; Supplier: LCSC
U7 = PC817C_C22447129: Supplier Part: C22447129; Manufacturer: JSMSEMI(杰盛微); Supplier Footprint: SOP-4; JLCPCB Part Class: Extended Part; Datasheet: https://item.szlcsc.com/datasheet/PC817C/24102051.html; Supplier: LCSC; Input type: DC; Output Type: Phototransistor; Voltage - Forward(Vf): 1.2V; Output Current: 50mA; Isolation Voltage(Vrms): 5kV; Reverse Voltage: 6V; Load Voltage: 80V; Vce Saturation(VCE(sat)): 100mV@20mA,1mA; Rise time: 4us; Fall time: 3us; Operating Temperature: -55℃~+110℃; Current Transfer Ratio (CTR) Minimum: 80%; Current Transfer Ratio (CTR) Maximum/Saturation Value: 600%; Forward Current(If): 50mA
C4 C8 = FCC0603B104K101CT: LCSC Part Name: 100nF ±10% 100V; Supplier Part: C5137616; Manufacturer: FOJAN(富捷); Supplier Footprint: 0603; JLCPCB Part Class: Extended Part; Datasheet: https://item.szlcsc.com/datasheet/FCC0603B104K101CT/5747068.html; Supplier: LCSC; Tolerance: ±10%; Voltage Rating: 100V; Temperature Coefficient: X7R
C5 C9 = GCM1885C2A221JA16D: LCSC Part Name: 220pF ±5% 100V; Supplier Part: C388907; Manufacturer: muRata(村田); Supplier Footprint: 0603; JLCPCB Part Class: Extended Part; Datasheet: https://item.szlcsc.com/datasheet/GCM1885C2A221JA16D/364231.html; Supplier: LCSC; Tolerance: ±5%; Voltage Rating: 100V; Temperature Coefficient: C0G
C6 C10 = 0402CG120J500NT: LCSC Part Name: 12pF ±5% 50V; Supplier Part: C1547; Manufacturer: FH(风华); Supplier Footprint: 0402; JLCPCB Part Class: Basic Part; Datasheet: https://item.szlcsc.com/datasheet/0402CG120J500NT/1899.html; Supplier: LCSC; Tolerance: ±5%; Voltage Rating: 50V; Temperature Coefficient: C0G
C55-C58 = CS3225X7R106K500NRL: LCSC Part Name: 10uF 50V; Supplier Part: C2918502; Manufacturer: SAMWHA(三和); Supplier Footprint: 1210; JLCPCB Part Class: Extended Part; Datasheet: https://item.szlcsc.com/datasheet/CS3225X7R106K500NRL/3220354.html; Supplier: LCSC; Voltage Rating: 50V; Temperature Coefficient: X7R
C59 C60 = TCC0603X7R104K500CT: LCSC Part Name: 100nF ±10% 50V; Supplier Part: C282519; Manufacturer: CCTC(三环); Supplier Footprint: 0603; JLCPCB Part Class: Extended Part; Datasheet: https://item.szlcsc.com/datasheet/TCC0603X7R104K500CT/268639.html; Supplier: LCSC; Tolerance: ±10%; Voltage Rating: 50V; Temperature Coefficient: X7R
C61 C62 = FCC0805X226M250FT: LCSC Part Name: 22uF ±20% 25V; Supplier Part: C7419435; Manufacturer: FOJAN(富捷); Supplier Footprint: 0805; JLCPCB Part Class: Extended Part; Datasheet: https://item.szlcsc.com/datasheet/FCC0805X226M250FT/8393417.html; Supplier: LCSC; Tolerance: ±20%; Voltage Rating: 25V; Temperature Coefficient: X5R
D5 D6 = SS510_C47147615: LCSC Part Name: SBD肖特基二极管; Supplier Part: C47147615; Manufacturer: YONGYUTAI(永裕泰); Supplier Footprint: SMA; JLCPCB Part Class: Extended Part; Datasheet: https://item.szlcsc.com/datasheet/SS510/49348153.html; Supplier: LCSC; Voltage - DC Reverse(Vr): 100V; Current - Rectified: 5A; Non-Repetitive Peak Forward Surge Current: 100A
D10 = VS-12CWQ04FNTR-M3: LCSC Part Name: 电压:40V 电流:6A; Supplier Part: C468048; Manufacturer: VISHAY(威世); Supplier Footprint: DPAK(TO-252AA); JLCPCB Part Class: Extended Part; Datasheet: https://item.szlcsc.com/datasheet/VS-12CWQ04FNTR-M3/473463.html; Supplier: LCSC; Diode Configuration: 1 Pair Common Cathode; Voltage - Forward(Vf@If): 680mV@12A; Voltage - DC Reverse(Vr): 40V; Current - Rectified: 6A; Reverse Leakage Current (Ir): 3mA@40V; Operating Junction Temperature Range: -55℃~+150℃; Non-Repetitive Peak Forward Surge Current: 550A
DC1 = DC005: LCSC Part Name: DC电源插座 内径:2mm 外径:6.3mm; Supplier Part: C431533; Manufacturer: SHOU HAN(首韩); Supplier Footprint: 插件; JLCPCB Part Class: Extended Part; Datasheet: https://item.szlcsc.com/datasheet/DC005/427890.html; Supplier: LCSC; Connector Type: DC Power Jack; Mounting Type: Right Angle; Inside Contact Diameter: 2mm; Outside Contact Diameter: 6.3mm; Current Rating: 500mA; Voltage Rating (Max): 12V; Operating Temperature: -30℃~+70℃
L3 L4 = SMDRI129-330MT: LCSC Part Name: 33uH ±20% 4.25A; Supplier Part: C2924828; Manufacturer: SXN(顺翔诺); Supplier Footprint: SMD,12.5x12.5mm; JLCPCB Part Class: Extended Part; Datasheet: https://atta.szlcsc.com/upload/public/pdf/source/20211124/9B30950960349E81285E9EDEE1F3DB14.pdf; Supplier: LCSC; Tolerance: ±20%; Saturation Current (Isat): 4.25A; Type: 屏蔽电感
L9 = FNR6028S3R3MT: LCSC Part Name: 3.3uH ±20% 4.5A; Supplier Part: C528022; Manufacturer: cjiang(长江微电); Supplier Footprint: SMD,6x6mm; JLCPCB Part Class: Extended Part; Datasheet: https://item.szlcsc.com/datasheet/FNR6028S3R3MT/546332.html; Supplier: LCSC; Tolerance: ±20%; Current Rating: 3.8A; Current - Saturation(Isat): 4.5A; DC Resistance(DCR): 33mΩ; Type: Magnetic Shielded Inductor
L10 = SMNR4020-2.2UH: LCSC Part Name: 2.2uH ±20% 3.4A; Supplier Part: C135262; Manufacturer: SXN(顺翔诺); Supplier Footprint: SMD,4x4mm; JLCPCB Part Class: Extended Part; Datasheet: https://item.szlcsc.com/datasheet/SMNR4020-2.2UH/146573.html; Supplier: LCSC; Tolerance: ±20%; Current Rating: 3.4A; Current - Saturation(Isat): 3.4A; DC Resistance(DCR): 46mΩ
R7 R15 = FRC2512J912TS: LCSC Part Name: 9.1kΩ ±5% 1W 厚膜电阻; Supplier Part: C3000640; Manufacturer: FOJAN(富捷); Supplier Footprint: 2512; JLCPCB Part Class: Extended Part; Datasheet: https://item.szlcsc.com/datasheet/FRC2512J912TS/3481998.html; Supplier: LCSC; Type: Thick Film Resistor; Tolerance: ±5%; Power(Watts): 1W; Voltage-Supply(Max): 200V; Temperature Coefficient: ±100ppm/℃; Operating Temperature: -55℃~+155℃
R8 R9 R16 R17 = ERJ-8BWFR068V: LCSC Part Name: 68mΩ ±1% 1W 厚膜电阻; Supplier Part: C2075794; Manufacturer: PANASONIC(松下); Supplier Footprint: 1206; JLCPCB Part Class: Extended Part; Datasheet: https://atta.szlcsc.com/upload/public/pdf/source/20211021/FD91EEB7659096174A0D45269053F16E.pdf; Supplier: LCSC; Type: Thick Film Resistors; Tolerance: ±1%; Power(Watts): 1W; Temperature Coefficient: 0ppm/℃~+100ppm/℃; Operating Temperature Range: -55℃~+155℃
R10 R18 = 0402WGJ047JTCE: LCSC Part Name: 4.7Ω ±5% 62.5mW 厚膜电阻; Supplier Part: C25169; Manufacturer: UNI-ROYAL(厚声); Supplier Footprint: 0402; JLCPCB Part Class: Extended Part; Datasheet: https://item.szlcsc.com/datasheet/0402WGJ047JTCE/25912.html; Supplier: LCSC; Type: Thick Film Resistor; Tolerance: ±5%; Power(Watts): 62.5mW; Voltage-Supply(Max): 50V; Temperature Coefficient: ±200ppm/℃; Operating Temperature: -55℃~+155℃
R11 R19 = FRC0603J220 TS: LCSC Part Name: 22Ω ±5% 100mW 厚膜电阻; Supplier Part: C2907129; Manufacturer: FOJAN(富捷); Supplier Footprint: 0603; JLCPCB Part Class: Extended Part; Supplier: LCSC; Type: Thick Film Resistor; Tolerance: ±5%; Power(Watts): 100mW; Voltage-Supply(Max): 75V; Temperature Coefficient: ±100ppm/℃; Operating Temperature: -55℃~+155℃
R12 R20 = RMC040230.1K1%N: LCSC Part Name: 厚膜电阻 30.1kΩ ±1% 62.5mW; Supplier Part: C325526; Manufacturer: Tyohm(幸亚电阻); Supplier Footprint: 0402; JLCPCB Part Class: Extended Part; Datasheet: https://item.szlcsc.com/datasheet/RMC040230.1K1%2525N/305731.html; Supplier: LCSC; Type: Thick Film Resistor; Tolerance: ±1%; Power(Watts): 62.5mW; Voltage-Supply(Max): 50V; Temperature Coefficient: ±100ppm/℃; Operating Temperature: -55℃~+155℃
R13 = FRC0402F5231TS: LCSC Part Name: 5.23kΩ ±1% 62.5mW 厚膜电阻; Supplier Part: C2933105; Manufacturer: FOJAN(富捷); Supplier Footprint: 0402; JLCPCB Part Class: Extended Part; Supplier: LCSC; Type: Thick Film Resistor; Tolerance: ±1%; Power(Watts): 62.5mW; Voltage-Supply(Max): 50V; Temperature Coefficient: ±100ppm/℃; Operating Temperature: -55℃~+155℃
R21 = FRC0402F9761TS: LCSC Part Name: 9.76kΩ ±1% 62.5mW 厚膜电阻; Supplier Part: C2998101; Manufacturer: FOJAN(富捷); Supplier Footprint: 0402; JLCPCB Part Class: Extended Part; Supplier: LCSC; Type: Thick Film Resistor; Tolerance: ±1%; Power(Watts): 62.5mW; Voltage-Supply(Max): 50V; Temperature Coefficient: ±100ppm/℃; Operating Temperature: -55℃~+155℃
R71 = RMC060356.2K1%N: LCSC Part Name: 厚膜电阻 56.2kΩ ±1% 100mW; Supplier Part: C325700; Manufacturer: Tyohm(幸亚电阻); Supplier Footprint: 0603; JLCPCB Part Class: Extended Part; Datasheet: https://item.szlcsc.com/datasheet/RMC060356.2K1%2525N/305905.html; Supplier: LCSC; Type: Thick Film Resistor; Tolerance: ±1%; Power(Watts): 100mW; Voltage-Supply(Max): 50V; Temperature Coefficient: ±100ppm/℃; Operating Temperature: -55℃~+155℃
R72 R74 = RC0805FR-0710KL: LCSC Part Name: 厚膜电阻 10kΩ ±1% 125mW; Supplier Part: C84376; Manufacturer: YAGEO(国巨); Supplier Footprint: 0805; JLCPCB Part Class: Extended Part; Datasheet: https://item.szlcsc.com/datasheet/RC0805FR-0710KL/85546.html; Supplier: LCSC; Type: Thick Film Resistor; Tolerance: ±1%; Power(Watts): 125mW; Voltage-Supply(Max): 150V; Temperature Coefficient: ±100ppm/℃; Operating Temperature: -55℃~+155℃
R73 = RMC060333.2K1%N: LCSC Part Name: 33.2kΩ ±1% 100mW; Supplier Part: C325687; Manufacturer: Tyohm(幸亚电阻); Supplier Footprint: 0603; JLCPCB Part Class: Extended Part; Datasheet: https://item.szlcsc.com/datasheet/RMC060333.2K1%2525N/305892.html; Supplier: LCSC; Type: Thick Film Resistor; Tolerance: ±1%; Power(Watts): 100mW; Voltage-Supply(Max): 50V; Temperature Coefficient: ±100ppm/℃; Operating Temperature: -55℃~+155℃
U2 U8 = TX4138: LCSC Part Name: 4A, 60V, 200KHz 降压转换器; Supplier Part: C329267; Manufacturer: XDS(芯鼎盛); Supplier Footprint: SOIC-8-EP; JLCPCB Part Class: Extended Part; Datasheet: https://item.szlcsc.com/datasheet/TX4138/308874.html; Supplier: LCSC; Function: Buck; Voltage - Supply: 4.5V~60V; Output Voltage: 800mV~40V; Output Current: 4A; Frequency - Switching: 200kHz; Operating Temperature: -40℃~+85℃@(TA); Synchronous Rectifier: No; Number of Outputs: 1; Topology: Buck; Quiescent Current: 400uA; Switch tube (built-in/external): Built-in; Output Type: Adjustable
U24 U25 = TPS563200DDCR: LCSC Part Name: 4.5V至17V输入，2A/3A同步降压稳压器; Supplier Part: C97253; Manufacturer: TI(德州仪器); Supplier Footprint: TSOT-23-6; JLCPCB Part Class: Extended Part; Datasheet: https://www.ti.com/cn/lit/gpn/tps563200; Supplier: LCSC; Function: Buck; Voltage - Supply: 4.5V~17V; Output Voltage: 760mV~7V; Output Current: 3A; Frequency - Switching: 650kHz; Operating Temperature: -40℃~+85℃@(TA); Synchronous Rectifier: Yes; Number of Outputs: 1; Topology: Buck; Switch tube (built-in/external): Built-in; Output Type: Adjustable
U16 = SN74LVC2T45DCUR: Supplier Part: C15741; Manufacturer: TI(德州仪器); Supplier Footprint: VSSOP-8-0.5mm; JLCPCB Part Class: Extended Part; Datasheet: https://www.ti.com/cn/lit/gpn/sn74lvc2t45; Supplier: LCSC; Operating Temperature: -40℃~+85℃
C54 = 0402X105K160NT: LCSC Part Name: 1uF ±10% 16V; Supplier Part: C167339; Manufacturer: FH(风华); Supplier Footprint: 0402; JLCPCB Part Class: Extended Part; Datasheet: https://atta.szlcsc.com/upload/public/pdf/source/20180118/C167339_15162576769601279689.pdf; Supplier: LCSC; Voltage Rated: 16V
D7 = USBLC6-2SC6_C2827654: LCSC Part Name: ESD，可防30kV静电; Supplier Part: C2827654; Manufacturer: TECH PUBLIC(台舟); Supplier Footprint: SOT-23-6; JLCPCB Part Class: Extended Part; Datasheet: https://item.szlcsc.com/datasheet/USBLC6-2SC6/2973336.html; Supplier: LCSC; Polarity: Unidirectional; Reverse Stand-Off Voltage (Vrwm): 5V; Clamping Voltage: 12V; Peak Pulse Current (Ipp): 6A; Peak Pulse Power Dissipation (Ppp): 150W; Voltage - Breakdown: 6V; Reverse Leakage Current (Ir): 80nA; Number of Channels: 2; Operating Temperature: -55℃~+125℃; level of protection: IEC 61000-4-2；IEC 61000-4-4；IEC 61000-4-5; Type: ESD; Junction Capacitance: 0.35pF
Q3 = LBC846BPDW1T1G: Supplier Part: C189598; Manufacturer: LRC(乐山无线电); Supplier Footprint: SC-70-6(SOT-363); JLCPCB Part Class: Extended Part; Datasheet: https://atta.szlcsc.com/upload/public/pdf/source/20180327/C189598_F805F27125D4E28BAA8444CFA30B6C17.pdf; Supplier: LCSC; Transistor Type: 1 NPN,1 PNP; Collector-Emitter Saturation Voltage (VCE(sat)@Ic,Ib): 600mV@100mA,5mA；650mV@100mA,5mA; DC Current Gain (hFE@Ic,Vce): 290@2mA,5V; Transition Frequency (fT): 100MHz; Operating Temperature: -55℃~+150℃@(Tj)
R34 R35 = RMC04025.1K5%N: LCSC Part Name: 厚膜电阻 5.1kΩ ±5% 62.5mW; Supplier Part: C325524; Manufacturer: Tyohm(幸亚电阻); Supplier Footprint: 0402; JLCPCB Part Class: Extended Part; Datasheet: https://item.szlcsc.com/datasheet/RMC04025.1K5%2525N/305729.html; Supplier: LCSC; Type: Thick Film Resistor; Tolerance: ±5%; Power(Watts): 62.5mW; Voltage-Supply(Max): 50V; Temperature Coefficient: ±100ppm/℃; Operating Temperature: -55℃~+155℃
R60 R65 R66 = RC0402FR-0710KL: LCSC Part Name: 厚膜电阻 10kΩ ±1% 62.5mW; Supplier Part: C60490; Manufacturer: YAGEO(国巨); Supplier Footprint: 0402; JLCPCB Part Class: Extended Part; Datasheet: https://item.szlcsc.com/datasheet/RC0402FR-0710KL/61542.html; Supplier: LCSC; Type: Thick Film Resistor; Tolerance: ±1%; Power(Watts): 62.5mW; Voltage-Supply(Max): 50V; Temperature Coefficient: ±100ppm/℃; Operating Temperature: -55℃~+155℃
R63 = RC0402FR-07499RL: LCSC Part Name: 499Ω ±1% 62.5mW; Supplier Part: C137970; Manufacturer: YAGEO(国巨); Supplier Footprint: 0402; JLCPCB Part Class: Extended Part; Datasheet: https://atta.szlcsc.com/upload/public/pdf/source/20171107/C137970_15100516073541096898.pdf; Supplier: LCSC; Type: Thick Film Resistors; Tolerance: ±1%
R69 = 0402WGF2212TCE: LCSC Part Name: 22.1kΩ ±1% 62.5mW; Supplier Part: C43473; Manufacturer: UNI-ROYAL(厚声); Supplier Footprint: 0402; JLCPCB Part Class: Extended Part; Datasheet: https://atta.szlcsc.com/upload/public/pdf/source/20200306/C422600_1E6D84923E4A46A82E41ADD87F860B5C.pdf; Supplier: LCSC; Type: Thick Film Resistors; Tolerance: ±1%; Temperature Coefficient: ±100ppm/℃; Operating Temperature Range: -55℃~+155℃
R70 = RC0603FR-0747K5L: LCSC Part Name: 47.5kΩ ±1%; Supplier Part: C137715; Manufacturer: YAGEO(国巨); Supplier Footprint: 0603; JLCPCB Part Class: Extended Part; Datasheet: https://atta.szlcsc.com/upload/public/pdf/source/20171106/C137715_15099606215621093860.pdf; Supplier: LCSC; Type: Thick Film Resistors
U22 = CP2102N-A02-GQFN28R: Supplier Part: C964632; Manufacturer: SKYWORKS/SILICON LABS(芯科); Supplier Footprint: QFN-28-EP(5x5); JLCPCB Part Class: Extended Part; Datasheet: https://item.szlcsc.com/datasheet/CP2102N-A02-GQFN28R/1049893.html; Supplier: LCSC; Applications Function: USB to UART; USB Protocol: USB 2.0; Voltage - Supply: 3V~3.6V; Operating Temperature: -40℃~+85℃@(Ta); Current - Supply: 9.5mA; Supply Current (Iq): 1.3uA
USB1 = TYPE-C 16PIN 2MD(073): LCSC Part Name: Type-C 母 卧贴; Supplier Part: C2765186; Manufacturer: SHOU HAN(首韩); Supplier Footprint: SMD; JLCPCB Part Class: Extended Part; Datasheet: https://item.szlcsc.com/datasheet/TYPE-C%252016PIN%25202MD(073)/2901843.html; Supplier: LCSC; Connector Type: Type-C; Gender: Female; Mounting Type: Surface Mount, Right Angle; Number of Contacts: 16P; Number of Ports: 1; Current Rating-Power: 3A; Voltage Rating: 5V; Connect-Disconnect Life: 5,000 Cycles; Detection color: Black; Operating Temperature: -25℃~+85℃

## Nets
+3.3V: C10.1 C11.1 C21.2 C46.1 C47.2 L4.2 L5.1 L8.1 Q2.2(S) R20.1 R25.2 R54.1 R55.1 R56.1 U21.28(VDD)
+3.3V_LAN: C23.1 C41.1 C42.1 C43.1 C44.1 C45.1 L7.2 R3.2 R4.2 R39.1 R40.1 R41.2 U21.4(AVDD) U21.8(AVDD) U21.11(AVDD) U21.15(AVDD) U21.17(AVDD) U21.21(AVDD)
+5V: C6.1 C7.1 C18.1 L3.2 R12.1 U12.3(VSS) U13.3(VSS) U14.3(VSS) U15.3(VSS) U17.5(VCC)
+12V: D10.2(C) R7.2 R8.1 R9.1 R14.2 R15.2 R16.1 R17.1 R22.2 U2.3(VIN) U8.3(VIN)
GND: C3.2 C5.1 C7.2 C9.1 C11.2 C12.2 C13.2 C16.1 C18.2 C19.1 C20.1 C22.1 C23.2 C30.1 C36.2 C37.2 C38.1 C39.1 C40.1 C41.2 C42.2 C43.2 C44.2 C45.2 C46.2 C47.1 C49.2 C50.1 C51.2 C52.2 C53.1 C54.2 C55.1 C56.1 C61.1 C62.1 D1.2(GND) D5.2(A) D6.2(A) D7.2(GND) DC1.2 DC1.3 Q1.2(E) R7.1 R13.1 R15.1 R21.1 R24.2 R34.1 R35.1 R42.1 R60.1 R70.1 R72.1 U2.4(GND) U6.5(-VDC) U6.8(-VDC) U7.3(EM) U8.4(GND) U12.1(VDD) U13.1(VDD) U14.1(VDD) U15.1(VDD) U17.3(GND) U21.3(AGND) U21.9(AGND) U21.14(AGND) U21.16(AGND) U21.19(AGND) U21.29(GND) U21.48(AGND) U22.3(GND) U22.29(EP) U23.1(GND) U23.28(GND) U24.1(GND) USB1.1(GND) USB1.12(GND) X1.2(GND) X1.4(GND)
AT_DET: U7.4(COL)
C6_3.3V: C12.1 C13.1 C16.2 L5.2 R38.2 U23.2(3V3)
C6_EN: C36.1 R38.1 R68.2 U23.3(EN)
C6_GPIO0: R67.2 U23.8(IO0)
C6_RXD0: R63.2 U23.24(RXD0)
C6_TXD0: R64.2 U23.25(TXD0)
CP_3.3V: C51.1 C52.1 C53.2 L8.2 R59.2 U22.6(VDD) U22.7(VREGIN)
LAN_ACT_LED: RJ1.12 U21.27(ACTLED)
LAN_CLK: R46.2
LAN_CS: R48.2
LAN_INT: R47.2
LAN_LNK_LED: RJ1.14 U21.25(LINKLED)
LAN_MISO: R44.2
LAN_MOSI: R45.2
LAN_PWR: Q1.1(B)
LAN_RST: R49.2
LAN_RXCT: C37.1 R1.1 R2.1 RJ1.3
LAN_RXN: D1.1(I/O1) R1.2 RJ1.1 RN1.3
LAN_RXP: D1.5(I/O4) R2.2 RJ1.2 RN1.4
LAN_TXCT: C38.2 R41.1 RJ1.4
LAN_TXN: D1.4(I/O3) R3.1 RJ1.5 RN1.1
LAN_TXP: D1.3(I/O2) R4.1 RJ1.6 RN1.2
POE_+12V: C3.1 D10.1(A) U6.6(+VDC)
POE_V+: L1.1 RJ1.9
POE_V-: L2.1 RJ1.10
USB_D+: D7.6(IO1) R61.1
USB_D-: D7.4(IO2) R62.1
USB_VBUS: D7.5(VBUS) R69.1 USB1.2(VBUS) USB1.11(VBUS)
WS2812: U17.2(A)
Net-(C2-1): C2.1 D4.1 L2.2 U6.2(VIN-)
Net-(C2-2): C2.2 D4.2 L1.2 U6.1(VIN+) U7.1(AN)
Net-(C4-1): C4.1 R10.2
Net-(C4-2): C4.2 D5.1(K) L3.1 R11.2 U2.1(SW)
Net-(C5-2): C5.2 R11.1
Net-(C6-2): C6.2 R12.2 R13.2 U2.5(FB)
Net-(C8-1): C8.1 R18.2
Net-(C8-2): C8.2 D6.1(K) L4.1 R19.2 U8.1(SW)
Net-(C9-2): C9.2 R19.1
Net-(C10-2): C10.2 R20.2 R21.2 U8.5(FB)
Net-(C19-2): C19.2 RJ1.GND2(GND)
Net-(C20-2): C20.2 RJ1.GND1(GND)
Net-(C21-1): C21.1 Q2.1(G) R25.1 R26.2
Net-(C22-2): C22.2 L7.1 Q2.3(D)
Net-(C30-2): C30.2 USB1.13(SHELL) USB1.14(SHELL)
Net-(C39-2): C39.2 U21.20(TOCAP)
Net-(C40-2): C40.2 U21.22(1V2O)
Net-(C49-1): C49.1 R43.1 U21.30(XI/CLKIN) X1.3(OSC2)
Net-(C50-2): C50.2 R43.2 U21.31(XO) X1.1(OSC1)
Net-(C54-1): C54.1 R69.2 R70.2 U22.8(VBUS)
Net-(C55-2): C55.2 C56.2 U24.3(VIN) U24.5(EN)
Net-(C59-1): C59.1 U24.6(VBST)
Net-(C59-2): C59.2 L9.1 U24.2(SW)
Net-(C61-2): C61.2 C62.2 L9.2 R71.2
Net-(D2-1): D2.1 RN1.8 U21.1(TXN)
Net-(D2-2): D2.2 RN1.7 U21.2(TXP)
Net-(D3-1): D3.1 RN1.5 U21.6(RXP)
Net-(D3-2): D3.2 RN1.6 U21.5(RXN)
Net-(D7-1): D7.1(IO1) USB1.6(DP1) USB1.8(DP2)
Net-(D7-3): D7.3(IO2) USB1.5(DN2) USB1.7(DN1)
Net-(D10-3): D10.3(A) DC1.1
Net-(Q1-3): Q1.3(C) R26.1
Net-(Q3-1): Q3.1(E2) R66.1 U22.28(DTR)
Net-(Q3-2): Q3.2(B2) R65.1
Net-(Q3-3): Q3.3(C1) R68.1
Net-(Q3-4): Q3.4(E1) R65.2 U22.24(RTS)
Net-(Q3-5): Q3.5(B1) R66.2
Net-(Q3-6): Q3.6(C2) R67.1
Net-(R8-2): R8.2 R9.2 U2.2(ILIM) U2.9(ILIM)
Net-(R10-1): R10.1 U2.8(BS)
Net-(R14-1): R14.1 U2.6(EN)
Net-(R16-2): R16.2 R17.2 U8.2(ILIM) U8.9(ILIM)
Net-(R18-1): R18.1 U8.8(BS)
Net-(R22-1): R22.1 U8.6(EN)
Net-(R23-1): R23.1 U17.4(Y)
Net-(R23-2): R23.2 U12.4(DIN)
Net-(R24-1): R24.1 U17.1(OE#)
Net-(R34-2): R34.2 USB1.10(CC2)
Net-(R35-2): R35.2 USB1.4(CC1)
Net-(R39-2): R39.2 RJ1.11
Net-(R40-2): R40.2 RJ1.13
Net-(R42-2): R42.2 U21.10(EXRES1)
Net-(R44-1): R44.1 U21.34(MISO)
Net-(R45-1): R45.1 U21.35(MOSI)
Net-(R46-1): R46.1 U21.33(SCLK)
Net-(R47-1): R47.1 U21.36(INTn)
Net-(R48-1): R48.1 U21.32(SCSn)
Net-(R49-1): R49.1 U21.37(RSTn)
Net-(R54-2): R54.2 U21.43(PMODE2)
Net-(R55-2): R55.2 U21.44(PMODE1)
Net-(R56-2): R56.2 U21.45(PMODE0)
Net-(R59-1): R59.1 U22.9(RSTb)
Net-(R60-2): R60.2 U22.11(SUSPENDb)
Net-(R61-2): R61.2 U22.4(D+)
Net-(R62-2): R62.2 U22.5(D-)
Net-(R63-1): R63.1 U22.26(TXD)
Net-(R64-1): R64.1 U22.25(RXD)
Net-(R71-1): R71.1 R72.2 U24.4(VFB)
Net-(U6-3): U6.3(AT-DET-) U7.2(CAT)
Net-(U12-2): U12.2(DOUT) U13.4(DIN)
Net-(U13-2): U13.2(DOUT) U14.4(DIN)
Net-(U14-2): U14.2(DOUT) U15.4(DIN)

Not connected (* = marked no-connect by the designer): C57 1 2; C58 1 2; C60 1 2; L10 1 2; R73 1 2; R74 1 2; RJ1 7* 8*; U2 7(POK)*; U6 4(CAP-)* 7(ADJ)*; U8 7(POK)*; U11 1(Reserved) 2(SS_N) 3(TIMEPULSE) 4(EXTINT0) 5(USB_DM) 6(USB_DP) 7(VDDUSB) 8(Reserved) 9(VCC_RF) 10(GND) 11(RF_IN) 12(GND) 13(GND) 14(MOSI/CFG_COM0) 15(MISO/CFG_COM1) 16(CFG_GPS0/SCK) 17(Reserved) 18(SDA2) 19(SCL2) 20(TxD1) 21(RxD1) 22(V_BCKP) 23(VCC) 24(GND); U15 2(DOUT)*; U16 1(VCCA) 2(A1) 3(A2) 4(GND) 5(DIR) 6(B2) 7(B1) 8(VCCB); U21 7(DNC)* 12(NC)* 13(NC)* 18(VBG)* 23(RSVD)* 24(SPDLED)* 26(DUPLED)* 38(RSVD)* 39(RSVD)* 40(RSVD)* 41(RSVD)* 42(RSVD)* 46(NC)* 47(NC)*; U22 1(DCD)* 2(RI/CLK)* 10(NC)* 12(SUSPEND)* 13(CHREN)* 14(CHR1)* 15(CHR0)* 16(GPIO.3/WAKEUP)* 17(GPIO.2/RS485)* 18(GPIO.1/RXT)* 19(GPIO.0/TXT)* 20(GPIO.6)* 21(GPIO.5)* 22(GPIO.4)* 23(CTS)* 27(DSR)*; U23 4(IO4) 5(IO5) 6(IO6) 7(IO7) 9(IO1) 10(IO8) 11(IO10) 12(IO11) 13(IO12) 14(IO13) 15(IO9) 16(IO18) 17(IO19) 18(IO20) 19(IO21) 20(IO22) 21(IO23) 22(NC)* 23(IO15) 26(IO3) 27(IO2) 29(GND) 30(GND) 31(GND) 32(GND) 33(GND) 34(GND) 35(GND) 36(GND) 37(GND); U25 1(GND) 2(SW) 3(VIN) 4(VFB) 5(EN) 6(VBST); USB1 3(SBU2)* 9(SBU1)*

# Schematic heca

## Sheets
1 PTC: Board Name: mpair; Create Date: 2026-01-03; Page Name: HECA; Project Name: mpair; Schematic Name: mpair; Update Date: 2026-01-03; Company: EasyEDA.com; Page Size: A4; Version: V1.0
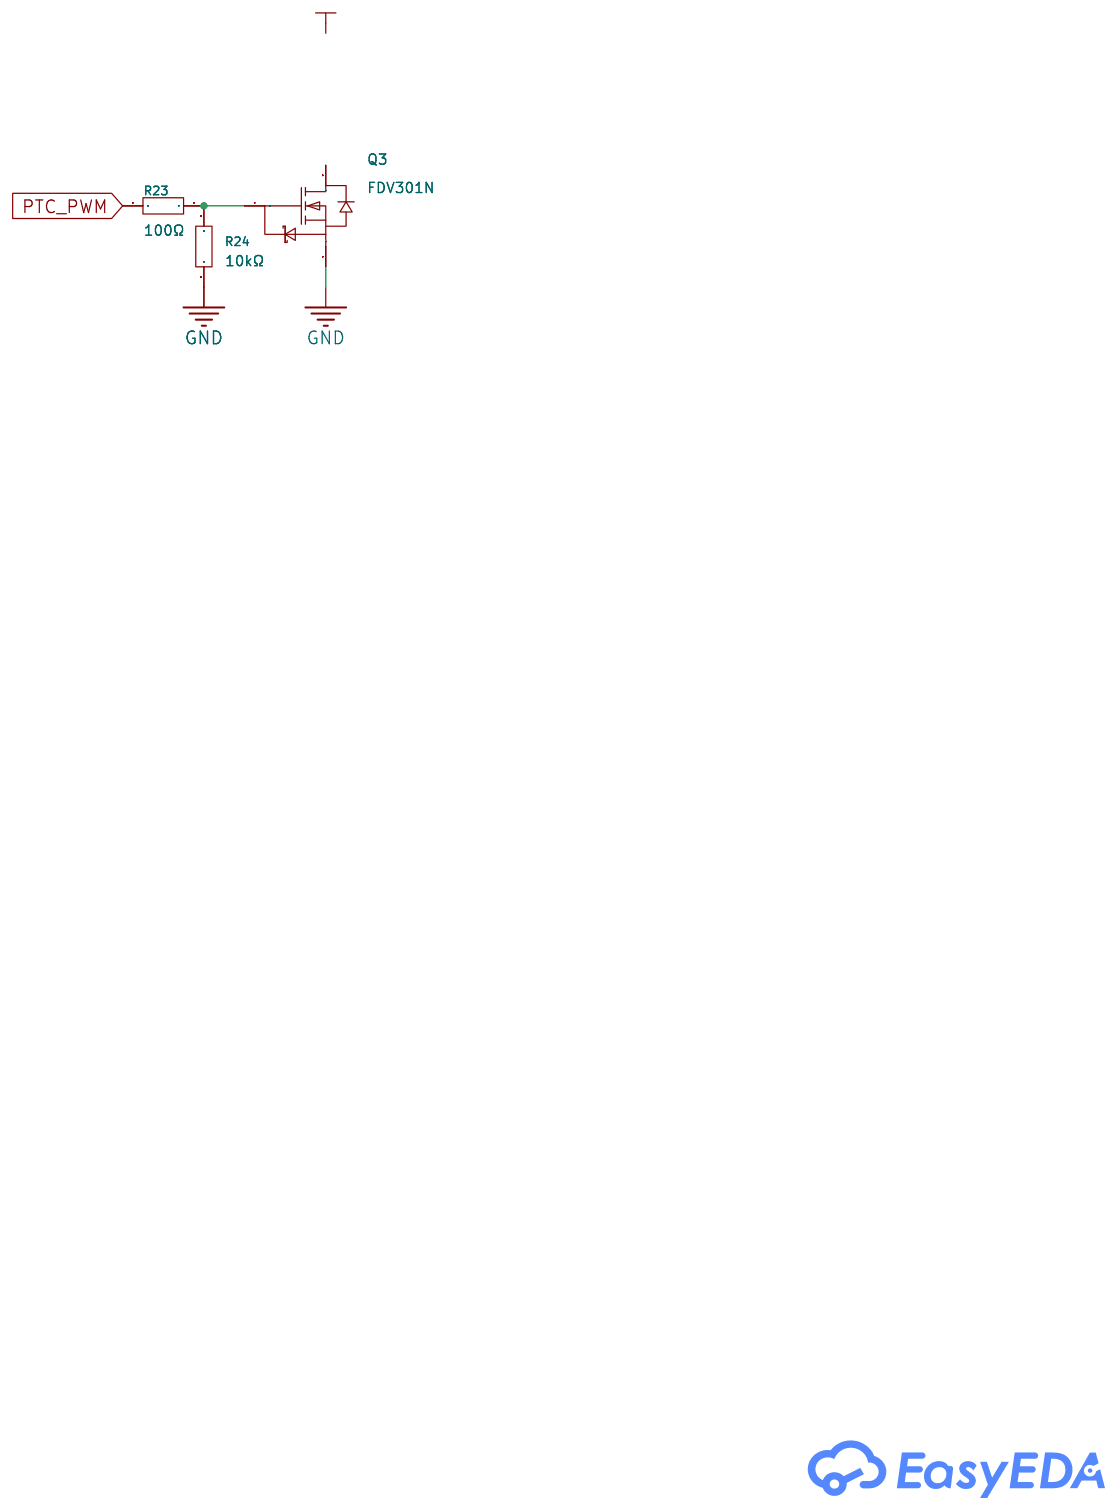
[diagram p8: PTC]
2 SHT31: Board Name: HECA; Page Name: SHT31; Schematic Name: heca
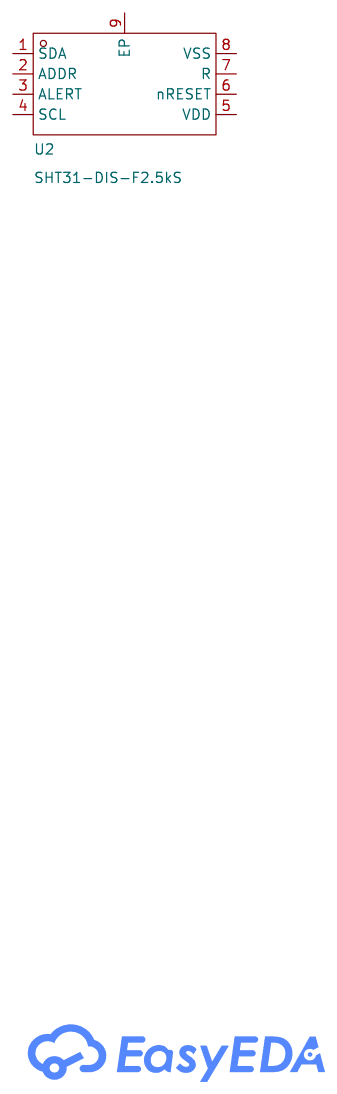
[diagram p9: SHT31]

## Parts
sheet PTC
Q3  FDV301N  [SOT-23_L2.9-W1.3-P1.90-LS2.4-BR]
R23  100Ω  [R0402]
R24  10kΩ  [R0402]
sheet SHT31
U2  SHT31-DIS-F2.5kS  [DFN-8_L2.5-W2.5-P0.50-BL-EP]

## Library data of the parts
Q3 = FDV301N: LCSC Part Name: 1个N沟道 耐压:25V 电流:0.22A; Supplier Part: C15310; Manufacturer: onsemi(安森美); Supplier Footprint: SOT-23; JLCPCB Part Class: Extended Part; Datasheet: https://item.szlcsc.com/datasheet/FDV301N/15987.html; Supplier: LCSC; Number: 1 N-Channel; Drain to Source Voltage: 25V; Current - Continuous Drain(Id): 220mA; RDS(on): 5Ω@2.7V,0.2A; Pd - Power Dissipation: 350mW; Gate Threshold Voltage (Vgs(th)): 1.06V@250uA; Gate Charge(Qg): 700pC@4.5V; Input Capacitance(Ciss): 9.5pF; Reverse Transfer Capacitance (Crss@Vds): 1.3pF; Operating Temperature: -55℃~+150℃; Type: N-Channel; Output Capacitance(Coss): 6pF
R23 = 0402WGJ0101TCE: LCSC Part Name: 100Ω ±5% 62.5mW 厚膜电阻; Supplier Part: C25138; Manufacturer: UNI-ROYAL(厚声); Supplier Footprint: 0402; JLCPCB Part Class: Extended Part; Datasheet: https://item.szlcsc.com/datasheet/0402WGJ0101TCE/25881.html; Supplier: LCSC; Type: Thick Film Resistor; Tolerance: ±5%; Power(Watts): 62.5mW; Voltage-Supply(Max): 50V; Temperature Coefficient: ±100ppm/℃; Operating Temperature: -55℃~+155℃
R24 = 0402WGJ0103TCE: LCSC Part Name: 10kΩ ±5% 62.5mW 厚膜电阻; Supplier Part: C25531; Manufacturer: UNI-ROYAL(厚声); Supplier Footprint: 0402; JLCPCB Part Class: Extended Part; Datasheet: https://item.szlcsc.com/datasheet/0402WGJ0103TCE/26274.html; Supplier: LCSC; Type: Thick Film Resistor; Tolerance: ±5%; Power(Watts): 62.5mW; Voltage-Supply(Max): 50V; Temperature Coefficient: ±100ppm/℃; Operating Temperature: -55℃~+155℃
U2 = SHT31-DIS-F2.5kS: LCSC Part Name: 1-101462-01; Supplier Part: C453460; Manufacturer: Sensirion(瑞士盛思锐); Supplier Footprint: DFN-8-EP(2.5x2.5); JLCPCB Part Class: Extended Part; Datasheet: https://atta.szlcsc.com/upload/public/pdf/source/20191108/C453460_03264038329C7E0127F8C91FAD7A185B.pdf; Supplier: LCSC; Supply Voltage: 2.15V~5.5V

## Nets
GND: Q3.2(S) R24.1
PTC_PWM: R23.1
Net-(Q3-1): Q3.1(G) R23.2 R24.2

Not connected (* = marked no-connect by the designer): Q3 3(D); U2 1(SDA) 2(ADDR) 3(ALERT) 4(SCL) 5(VDD) 6(nRESET) 7(R) 8(VSS) 9(EP)

# Schematic sensors

## Sheets
1 CO2: Board Name: SENSORS; Create Date: 2026-01-03; Page Name: CO2; Project Name: mpair; Schematic Name: sensors; Update Date: 2026-01-03; Company: EasyEDA.com; Page Size: A4; Version: V1.0
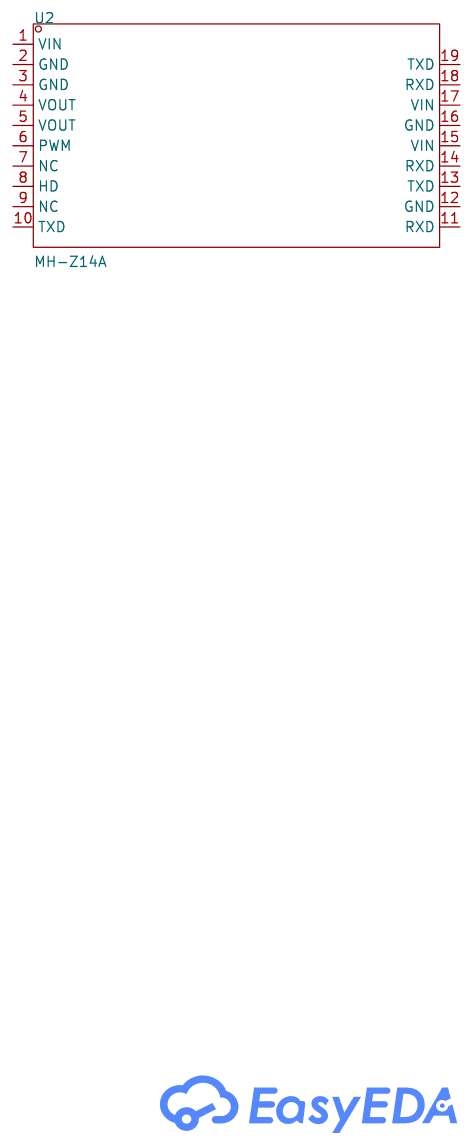
[diagram p10: CO2]
2 BME280: Page Name: BME280
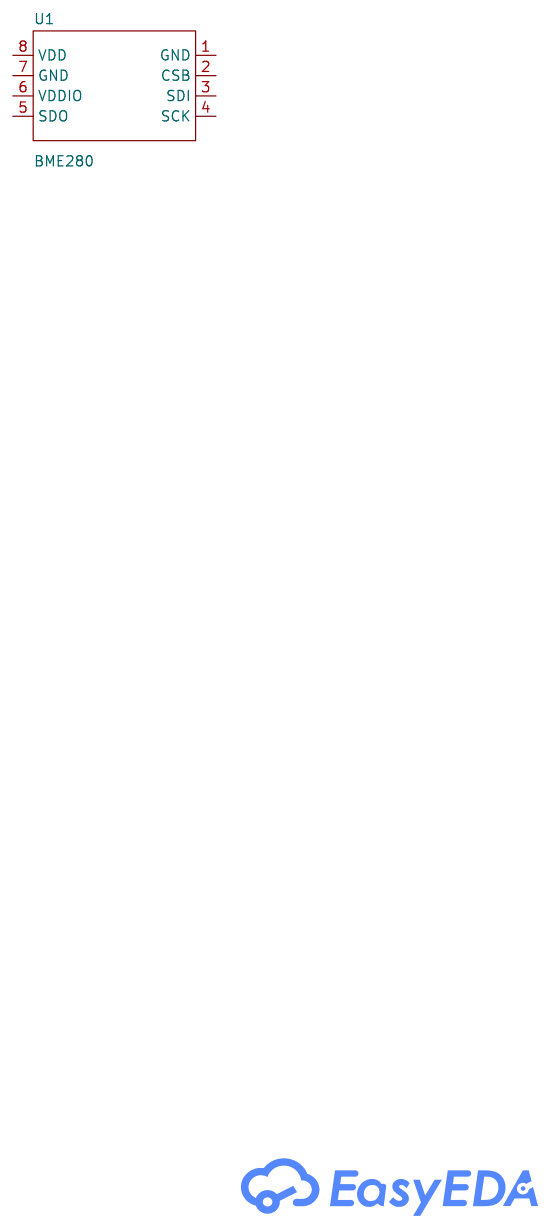
[diagram p11: BME280]
3 AHT20: Page Name: AHT20
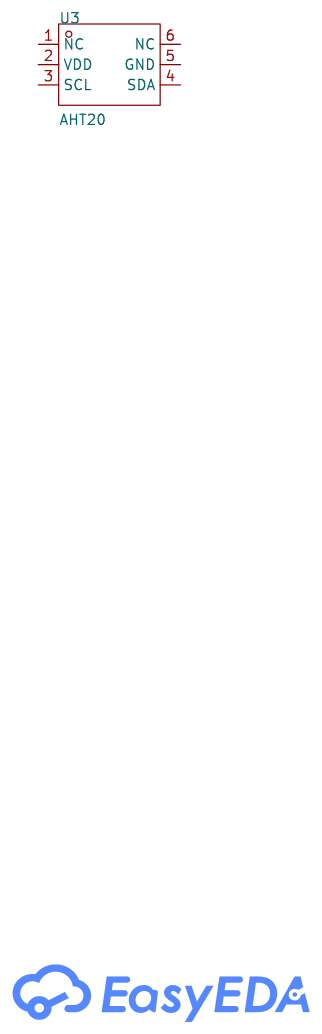
[diagram p12: AHT20]

## Parts
sheet AHT20
U3  AHT20  [SENSOR-SMD_L3.0-W3.0-P1.00-BR]
sheet BME280
U1  BME280  [LGA-8_BME280_BL]
sheet CO2
U2  MH-Z14A  [SENSORM-TH_MH-Z14A]

## Library data of the parts
U3 = AHT20: Supplier Part: C2757850; Manufacturer: 广州奥松; Supplier Footprint: SMD; JLCPCB Part Class: Extended Part; Datasheet: https://item.szlcsc.com/datasheet/AHT20/2874650.html; Supplier: LCSC
U1 = BME280: LCSC Part Name: 湿度：0%RH~100%RH; Supplier Part: C92489; Manufacturer: Bosch(博世); Supplier Footprint: LGA-8(2.5x2.5); JLCPCB Part Class: Extended Part; Datasheet: https://item.szlcsc.com/datasheet/BME280/93682.html; Supplier: LCSC; Temperature Range: -40℃~+85℃; Humidity: 0%RH~100%RH; Interface: I2C；SPI; Voltage - Supply: 1.71V~3.6V; Current - Supply: 1.8uA; Humidity Tolerance: ±3%RH; Temperature Tolerance: ±0.5℃; Resolution: 16bit
U2 = MH-Z14A: LCSC Part Name: 二氧化碳传感器模组; Supplier Part: C242512; Manufacturer: Winsen(炜盛); JLCPCB Part Class: Extended Part; Datasheet: https://atta.szlcsc.com/upload/public/pdf/source/20210201/C242512_F3FD18DAD59F990E0D60665563650B42.pdf; Supplier: LCSC

## Nets

Not connected (* = marked no-connect by the designer): U1 1(GND) 2(CSB) 3(SDI) 4(SCK) 5(SDO) 6(VDDIO) 7(GND) 8(VDD); U2 1(VIN) 2(GND) 3(GND) 4(VOUT) 5(VOUT) 6(PWM) 7(NC) 8(HD) 9(NC) 10(TXD) 11(RXD) 12(GND) 13(TXD) 14(RXD) 15(VIN) 16(GND) 17(VIN) 18(RXD) 19(TXD); U3 1(NC) 2(VDD) 3(SCL) 4(SDA) 5(GND) 6(NC)
